# EasyEDA Pro project ProPrj_tang25k_YT8531C_V2.0_2026-08-23.epro, schematic Schematic1

## Sheets
1 GPIO: Board Name: tang25k; Create Date: 2025-06-27; Page Name: GPIO; Project Name: tang25k_YT8531C_V2.0; Schematic Name: Schematic1; Update Date: 2025-07-03; Company: EasyEDA.com; Page Size: A4; Version: V1.0
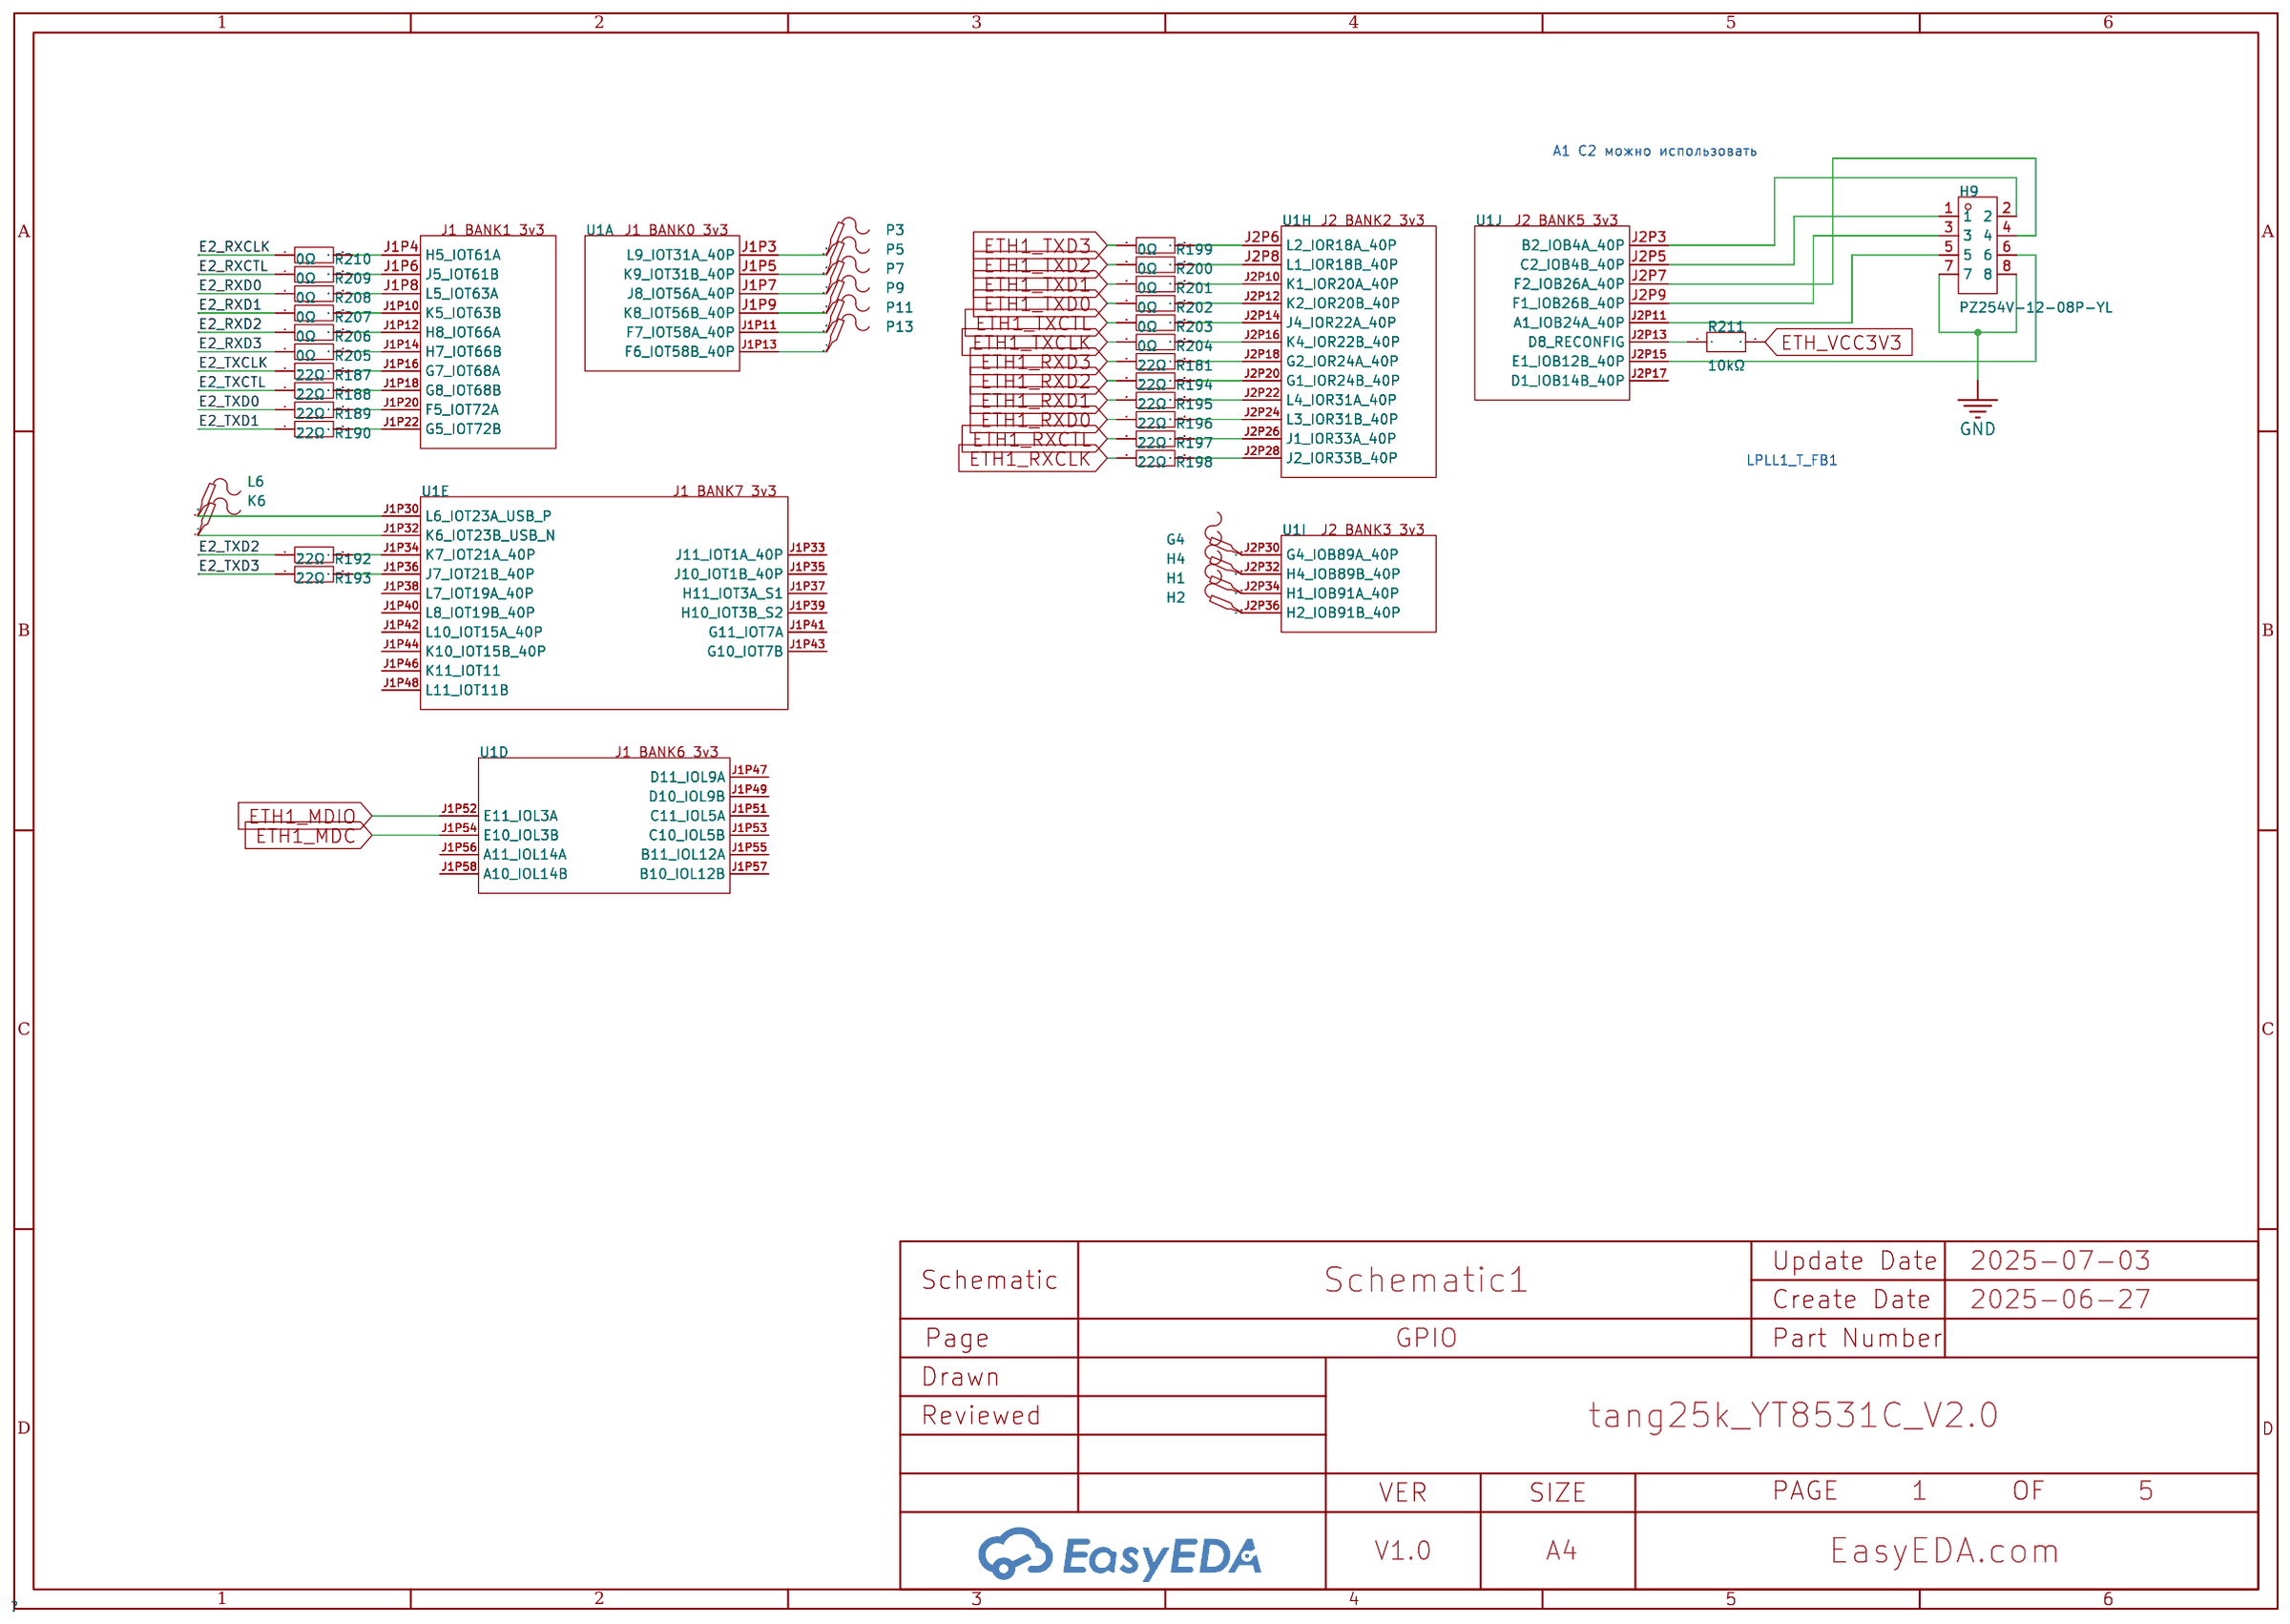
[diagram p1: GPIO]
2 power: Page Name: power; Update Date: 2025-07-04
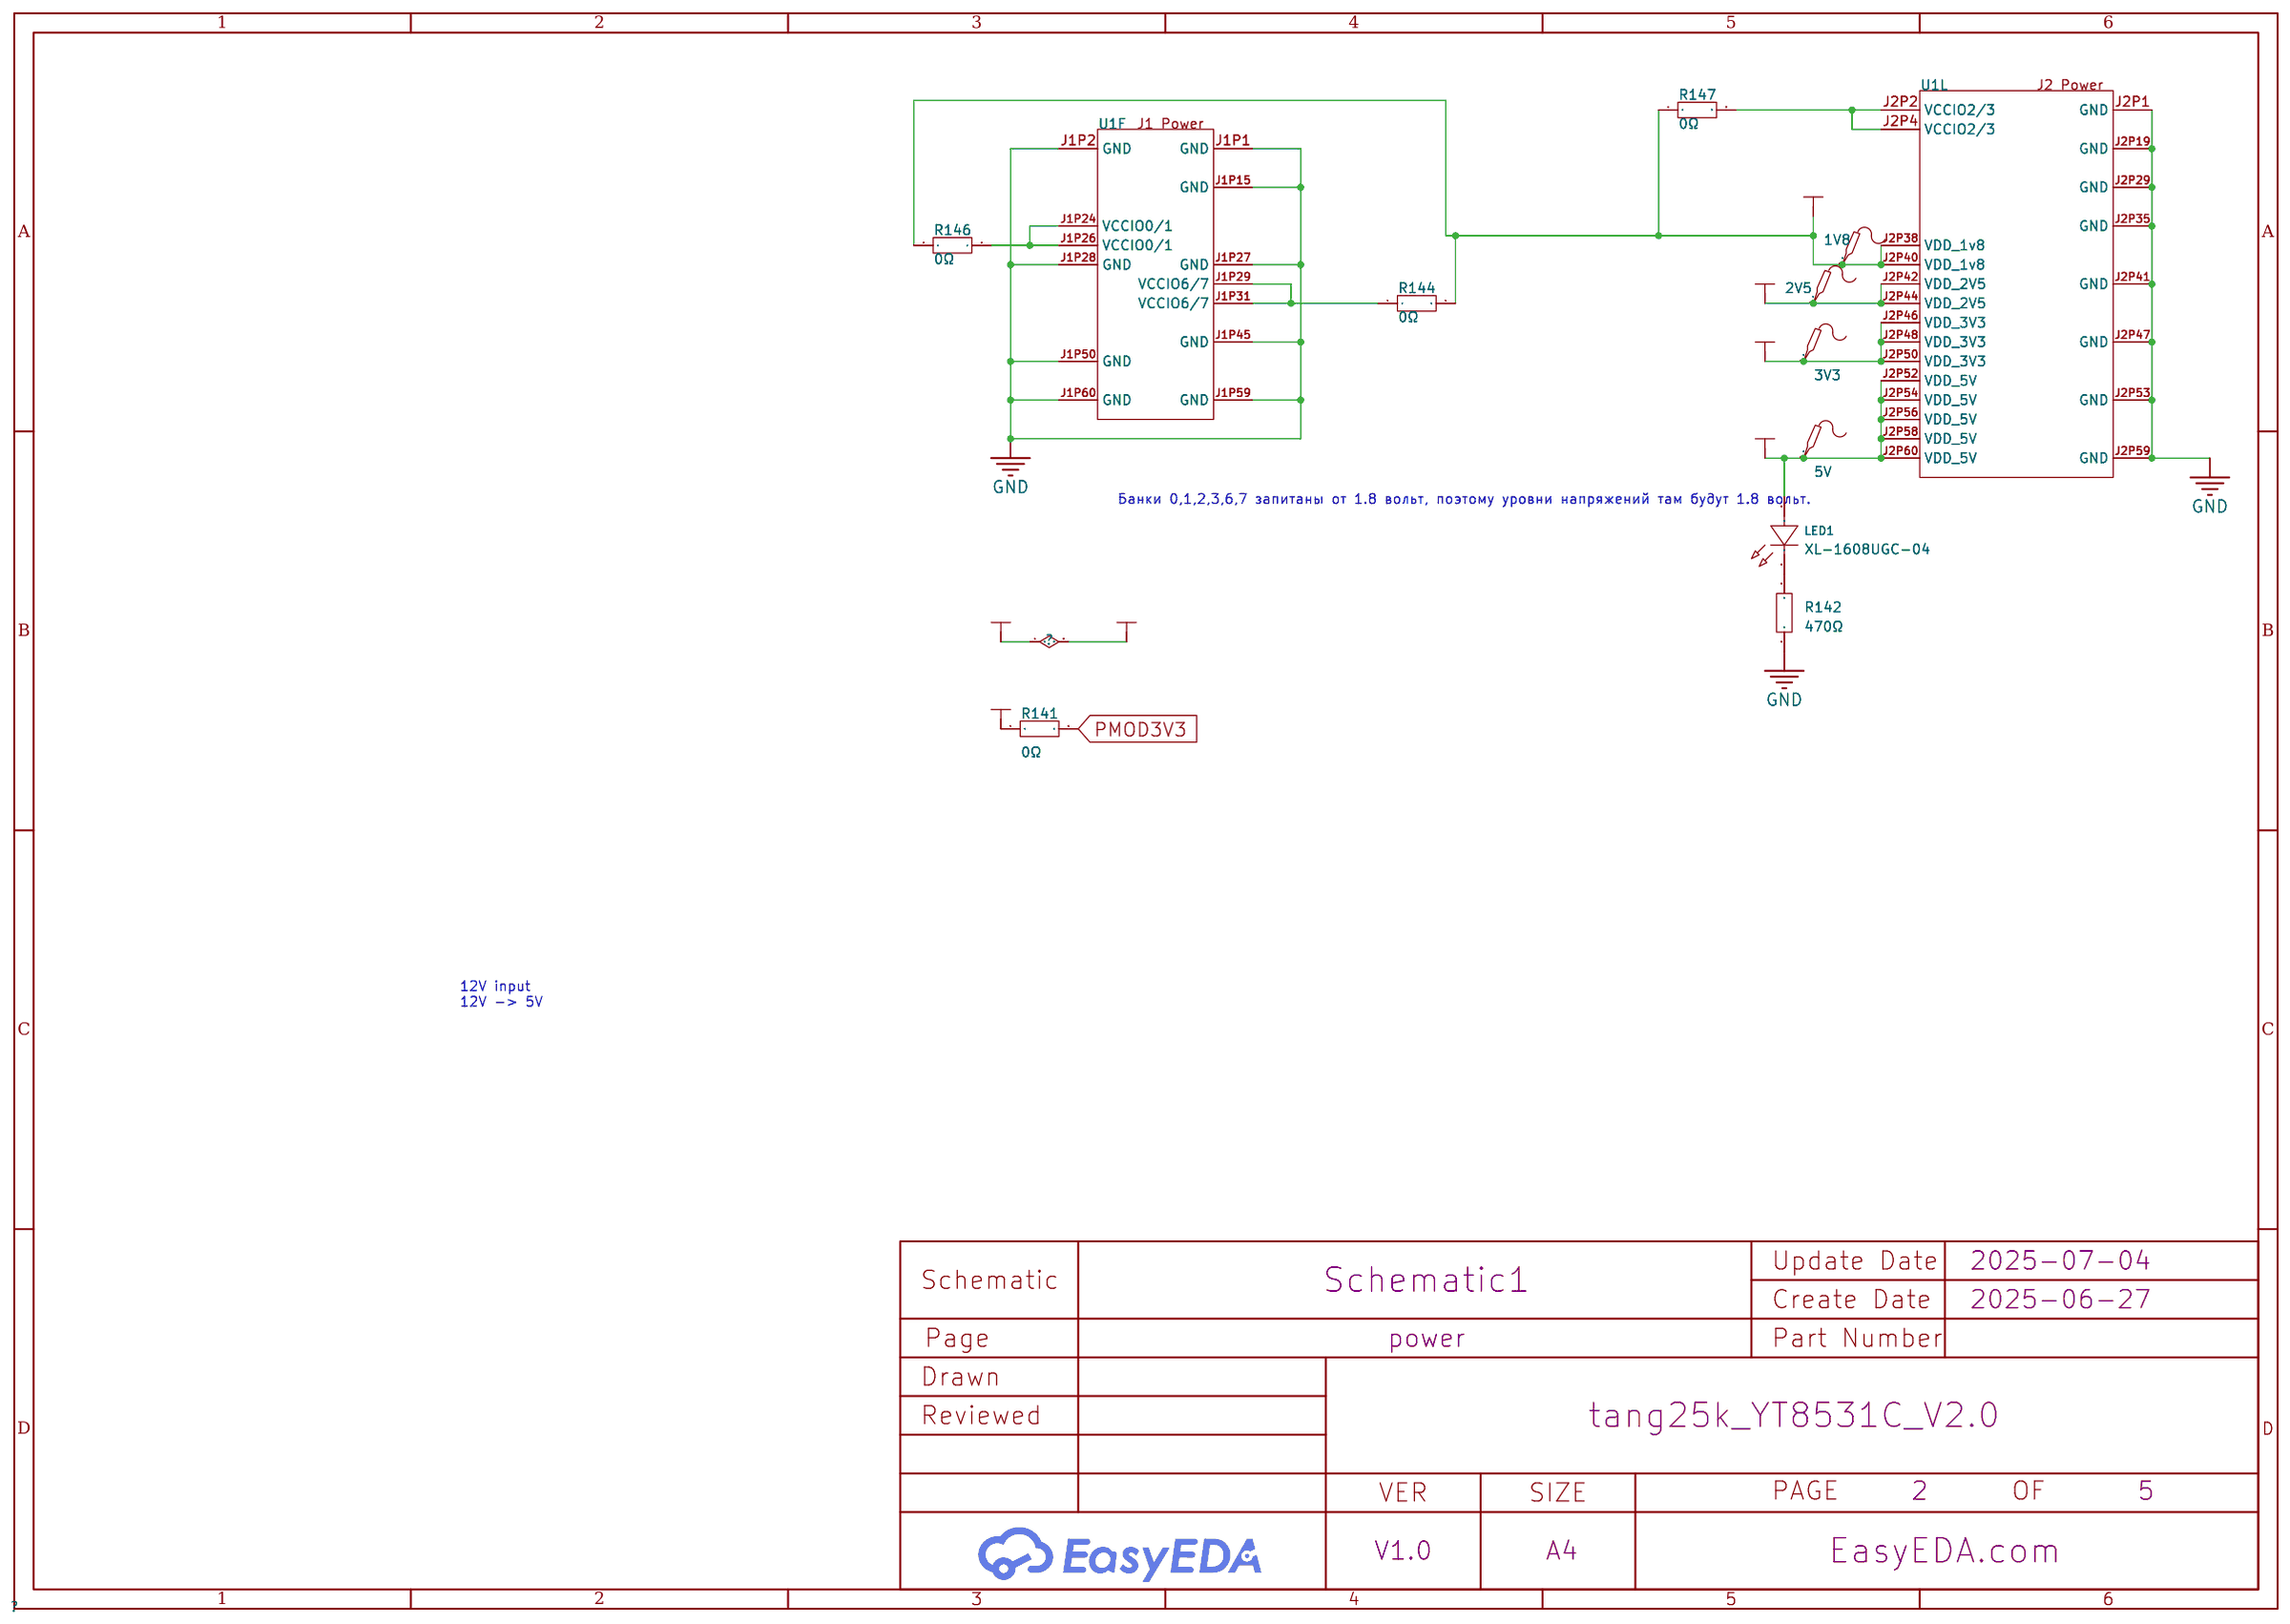
[diagram p2: power]
3 UART JTAG MIPI: Page Name: UART JTAG MIPI; Update Date: 2025-07-01
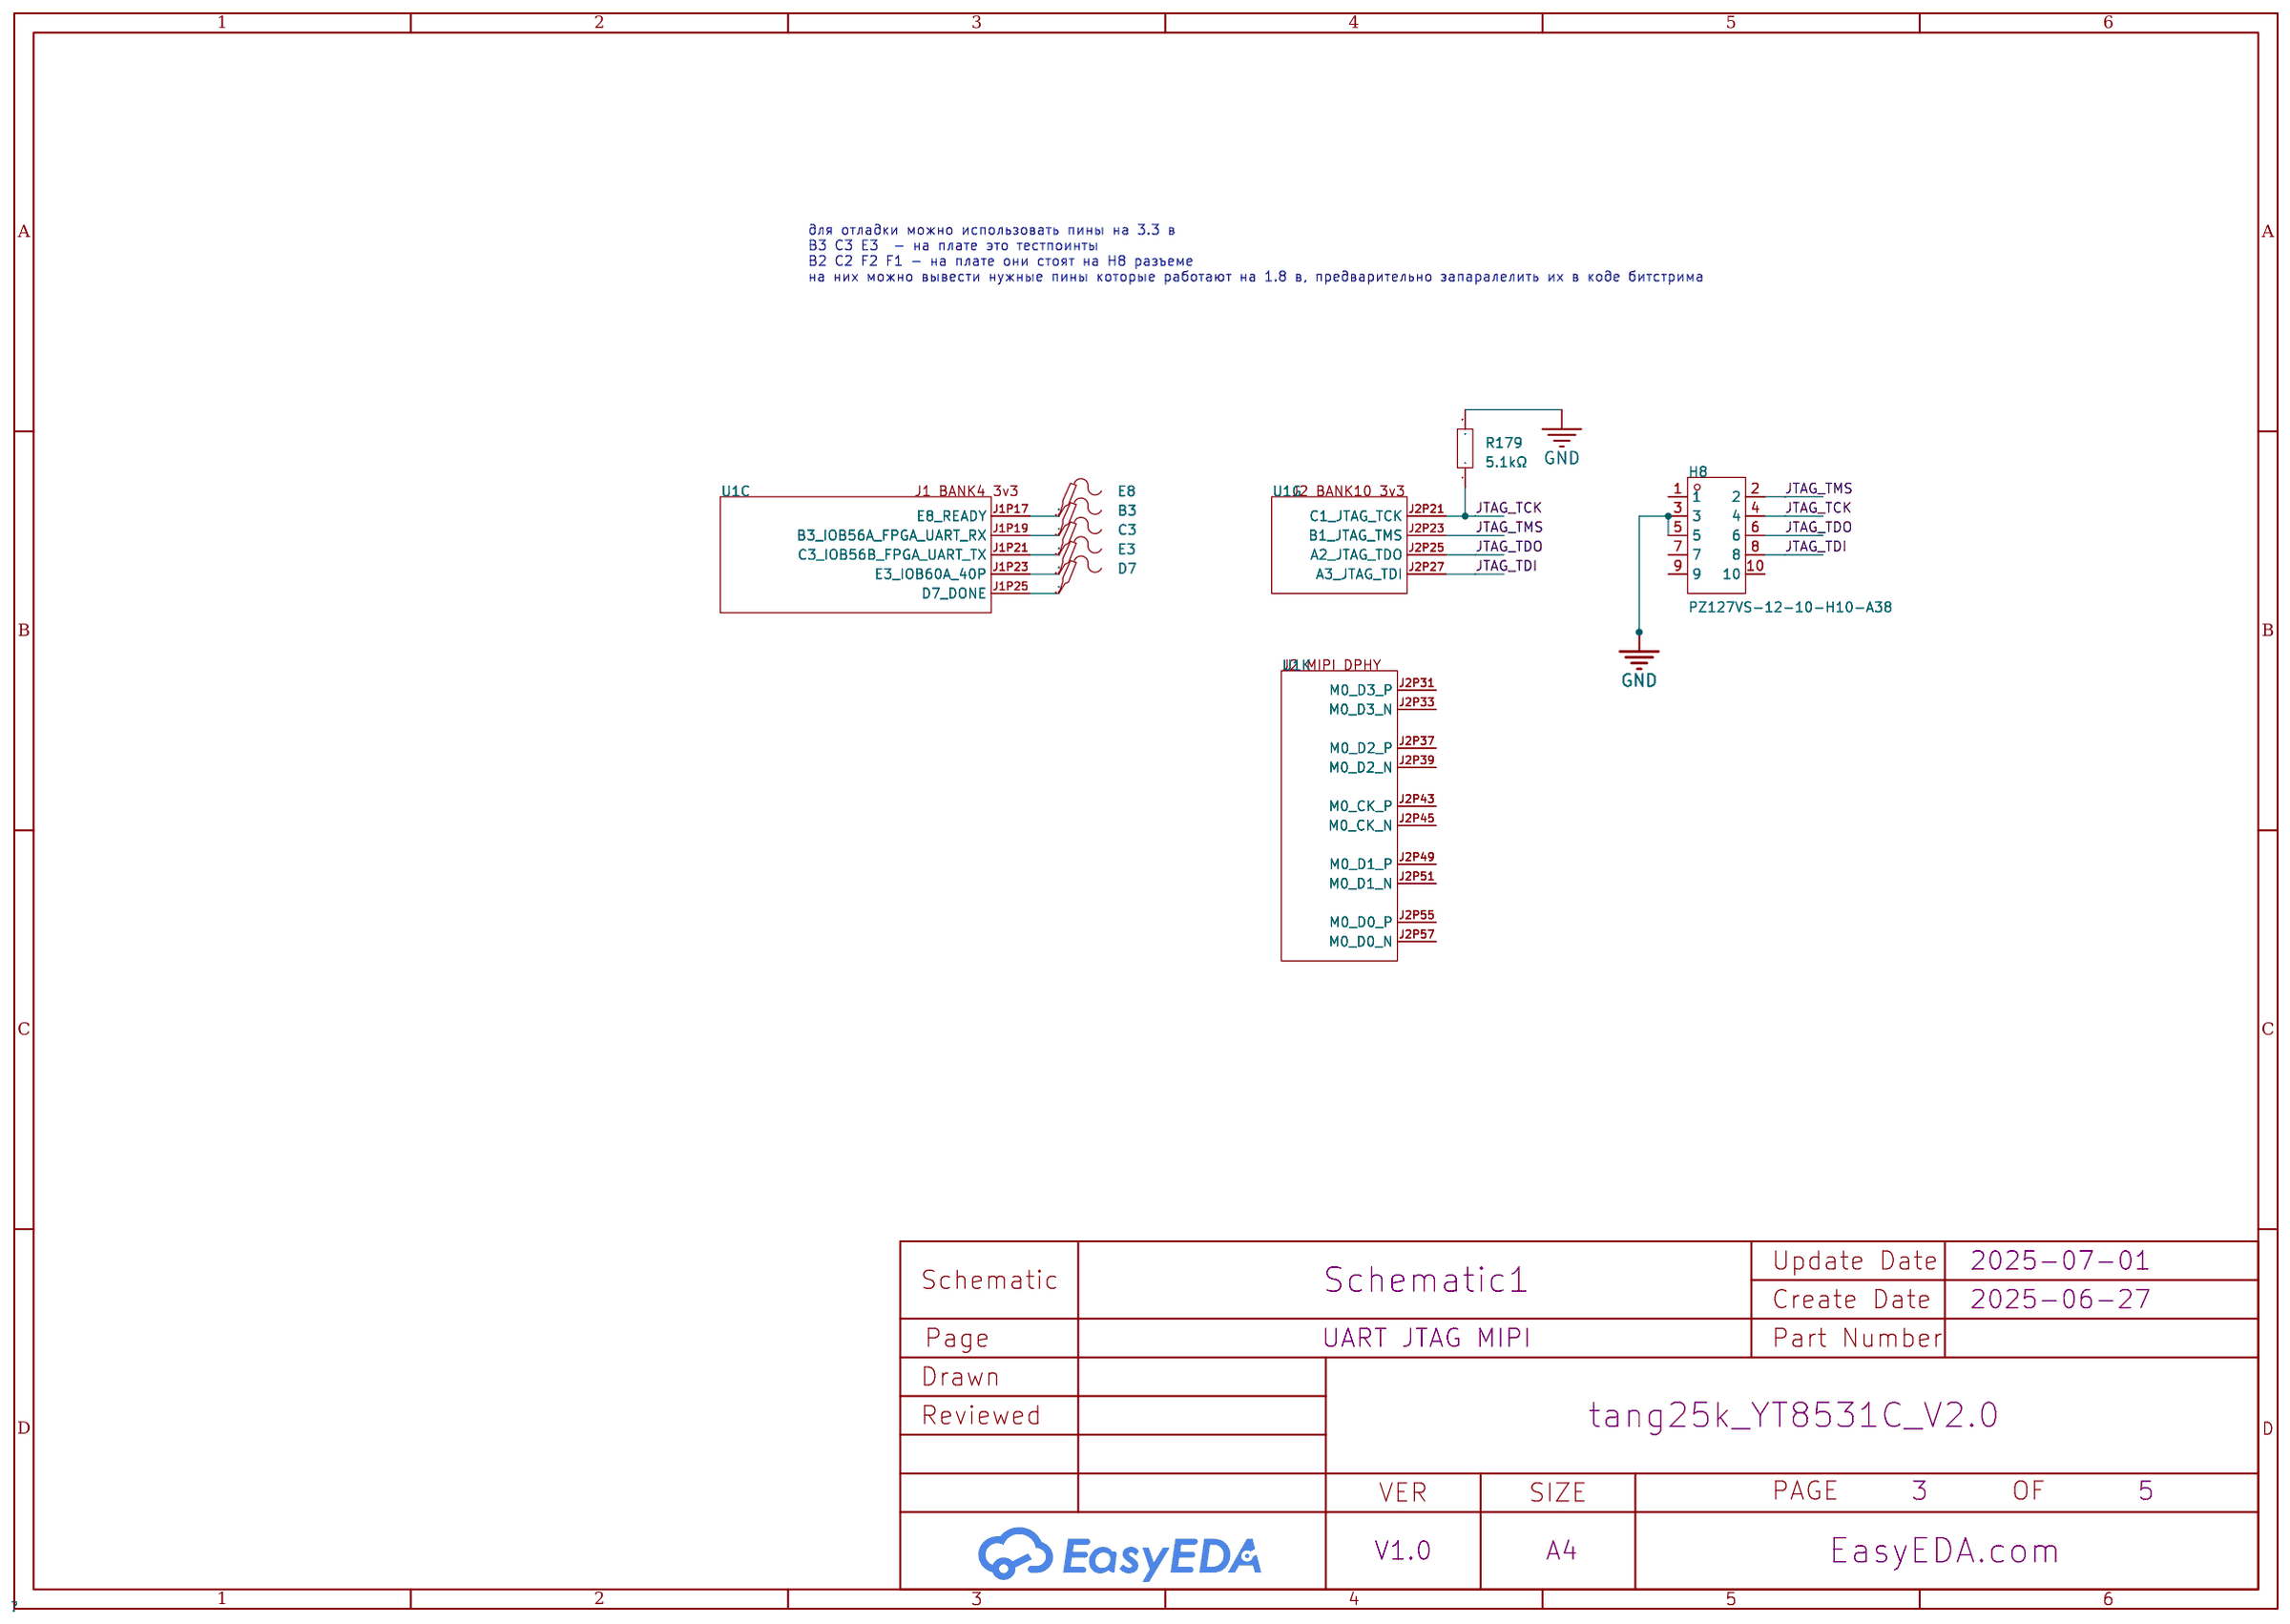
[diagram p3: UART JTAG MIPI]
4 ch1 copy: Page Name: ch1 copy; Add into BOM: yes; Company: Your Company; Convert to PCB: yes; Date: 2023-10-17; Draw By: asetmalik; REV: 1.0; Sheet: 1/1
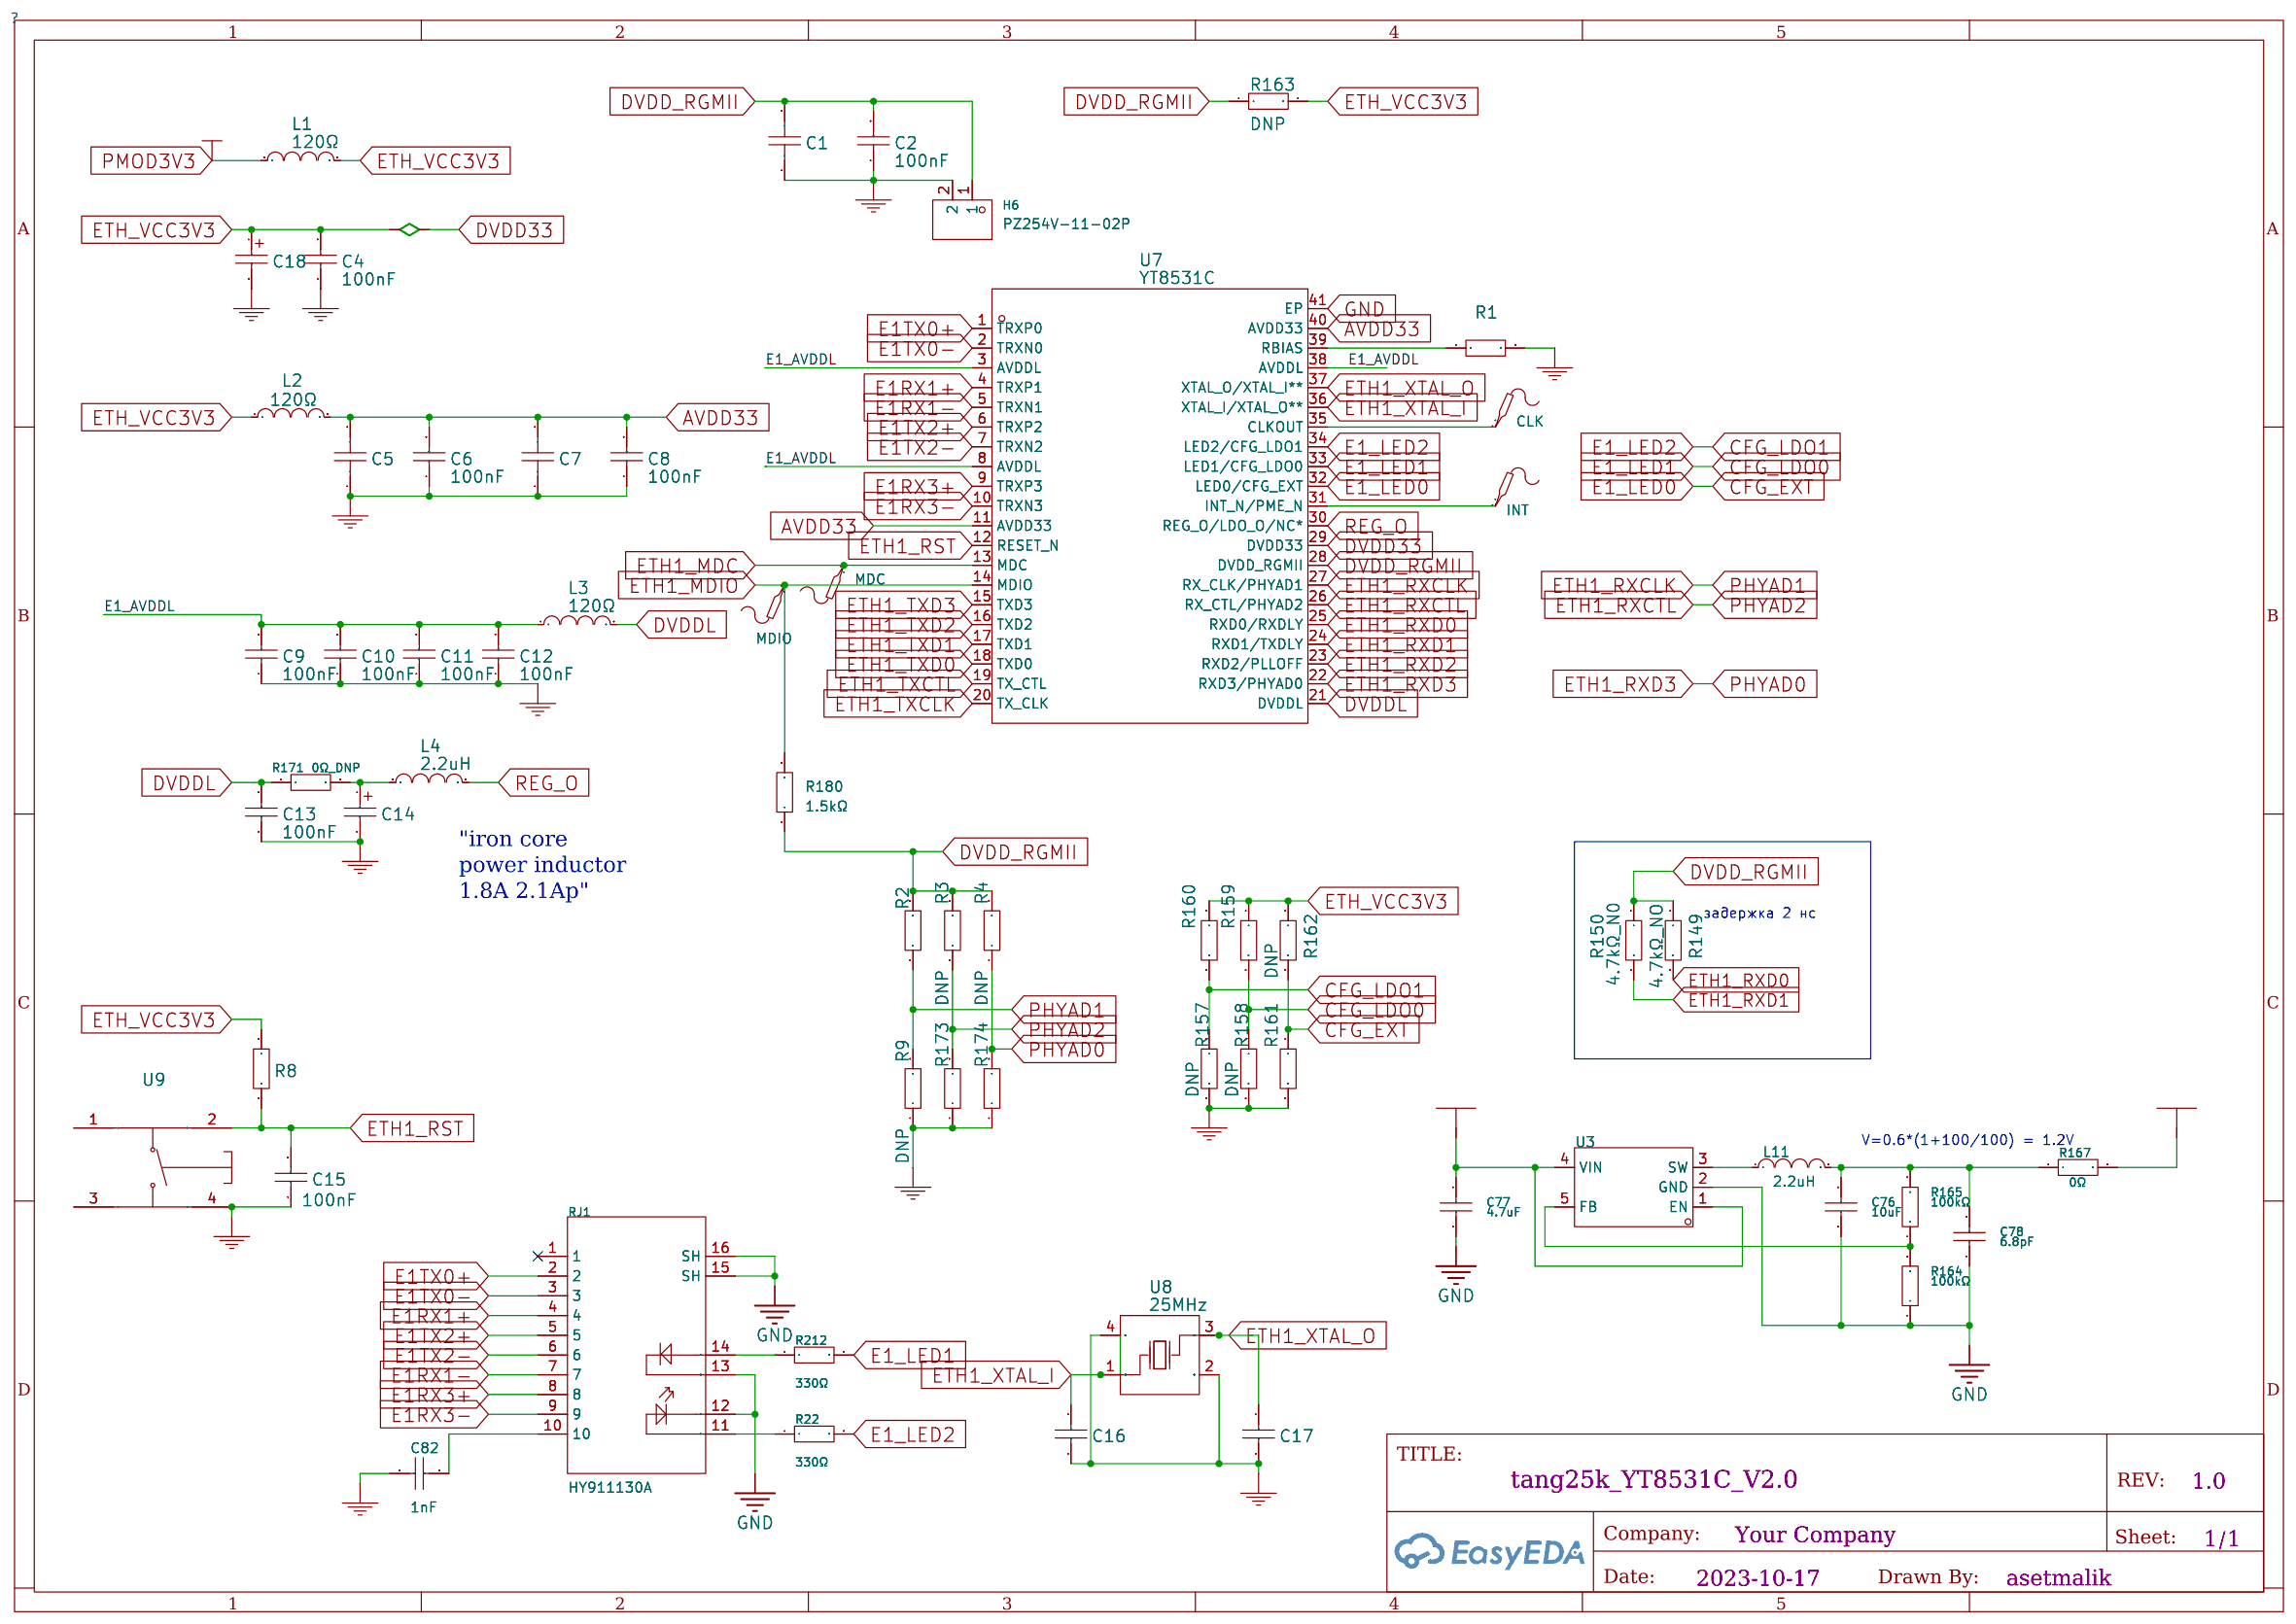
[diagram p4: ch1 copy]
5 ch2 copy: Page Name: ch2 copy; Update Date: 2025-07-02; Add into BOM: yes; Company: Your Company; Convert to PCB: yes; Date: 2023-10-17; Draw By: asetmalik; REV: 1.0; Sheet: 1/1
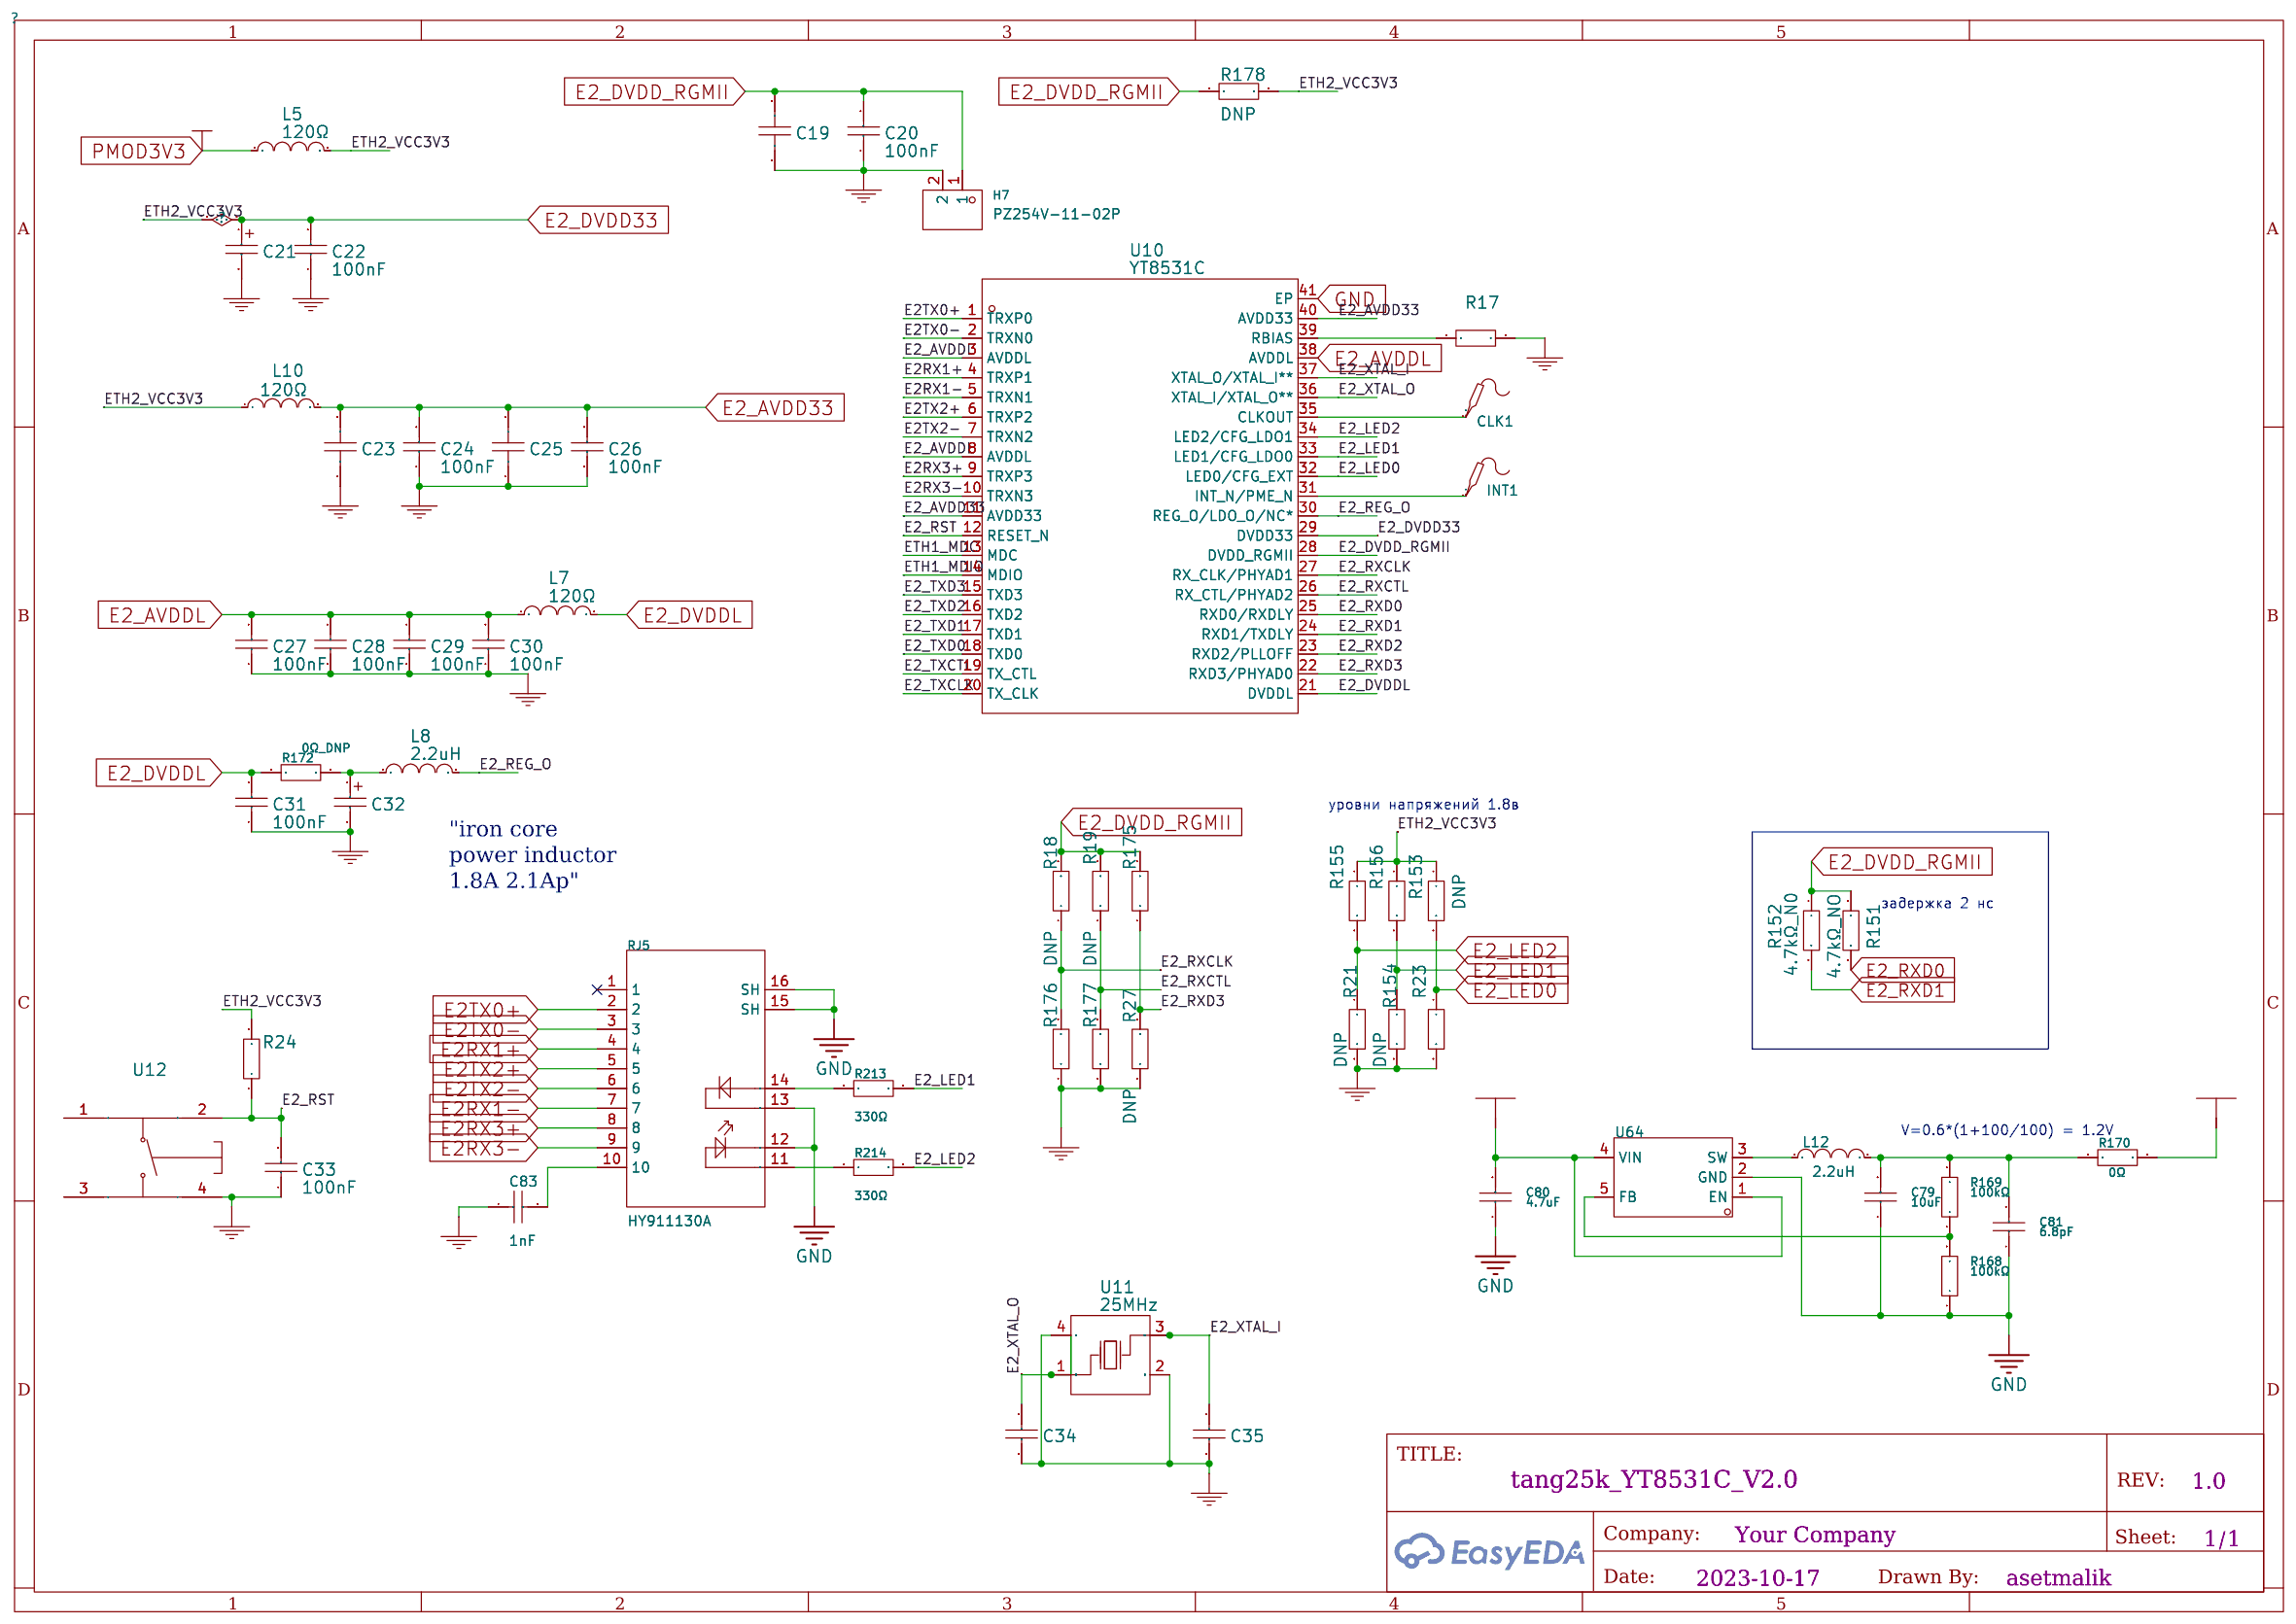
[diagram p5: ch2 copy]

## Parts
sheet ch1 copy
C1  1uF  [C0603]
C2  100nF  [C0603]
C4  100nF  [C0603]
C5  1uF  [C0603]
C6  100nF  [C0603]
C7  1uF  [C0603]
C8  100nF  [C0603]
C9  100nF  [C0603]
C10  100nF  [C0603]
C11  100nF  [C0603]
C12  100nF  [C0603]
C13  100nF  [C0603]
C14  10uF  [C0603]
C15  100nF  [C0603]
C16  12pF  [C0603]
C17  12pF  [C0603]
C18  10uF  [C0603]
C76  10uF  [C0402]
C77  4.7uF  [C0402]
C78  6.8pF  [C0402]
C82  1nF  [C1206]
CLK  -  [Test-Point-0.5mm]
H6  PZ254V-11-02P  [HDR-TH_2P-P2.54-V-M]
INT  -  [Test-Point-0.5mm]
L1  120Ω  [L0603]
L2  120Ω  [L0603]
L3  120Ω  [L0603]
L4  2.2uH  [IND-SMD_L2.5-W2.0_SLW252012P]
L11  2.2uH  [L0806]
MDC  -  [Test-Point-0.5mm]
MDIO  -  [Test-Point-0.5mm]
R1  2.49kΩ  [R0603]
R2  10kΩ  [R0603]
R3  10kΩ  [R0603]
R4  10kΩ  [R0603]
R8  4.7kΩ  [R0603]
R9  10kΩ  [R0603]
R22  330Ω  [R0402]
R149  4.7kΩ_NO  [R0603]
R150  4.7kΩ_N0  [R0603]
R157  4.7kΩ  [R0603]
R158  4.7kΩ  [R0603]
R159  4.7kΩ  [R0603]
R160  4.7kΩ  [R0603]
R161  4.7kΩ  [R0603]
R162  4.7kΩ  [R0603]
R163  4.7kΩ  [R0603]
R164  100kΩ  [R0402]
R165  100kΩ  [R0402]
R167  0Ω  [R0402]
R171  0Ω_DNP  [R0402]
R173  10kΩ  [R0603]
R174  10kΩ  [R0603]
R180  1.5kΩ  [R0603]
R212  330Ω  [R0402]
RJ1  HY911130A  [RJ45-TH_10P-P2.54-S2.54_L16.1-W21.4_HY911130A]
U3  TLV62569DBVR  [SOT-23-5_L3.0-W1.7-P0.95-LS2.8-BR]
U7  YT8531C  [QFN-40_L5.0-W5.0-P0.40-BL-EP3.7]
U8  25MHz  [CRYSTAL-SMD_4P-L2.5-W2.0-BL]
U9  TS-1187A-B-A-B  [SW-SMD_4P-L5.1-W5.1-P3.70-LS6.5-TL_H1.5]
sheet ch2 copy
C19  1uF  [C0603]
C20  100nF  [C0603]
C21  10uF  [C0603]
C22  100nF  [C0603]
C23  1uF  [C0603]
C24  100nF  [C0603]
C25  1uF  [C0603]
C26  100nF  [C0603]
C27  100nF  [C0603]
C28  100nF  [C0603]
C29  100nF  [C0603]
C30  100nF  [C0603]
C31  100nF  [C0603]
C32  10uF  [C0603]
C33  100nF  [C0603]
C34  12pF  [C0603]
C35  12pF  [C0603]
C79  10uF  [C0402]
C80  4.7uF  [C0402]
C81  6.8pF  [C0402]
C83  1nF  [C1206]
CLK1  -  [Test-Point-0.5mm]
H7  PZ254V-11-02P  [HDR-TH_2P-P2.54-V-M]
INT1  -  [Test-Point-0.5mm]
L5  120Ω  [L0603]
L7  120Ω  [L0603]
L8  2.2uH  [IND-SMD_L2.5-W2.0_SLW252012P]
L10  120Ω  [L0603]
L12  2.2uH  [L0806]
R17  2.49kΩ  [R0603]
R18  10kΩ  [R0603]
R19  10kΩ  [R0603]
R21  4.7kΩ  [R0603]
R23  4.7kΩ  [R0603]
R24  4.7kΩ  [R0603]
R27  10kΩ  [R0603]
R151  4.7kΩ_NO  [R0603]
R152  4.7kΩ_N0  [R0603]
R153  4.7kΩ  [R0603]
R154  4.7kΩ  [R0603]
R155  4.7kΩ  [R0603]
R156  4.7kΩ  [R0603]
R168  100kΩ  [R0402]
R169  100kΩ  [R0402]
R170  0Ω  [R0402]
R172  0Ω_DNP  [R0402]
R175  10kΩ  [R0603]
R176  10kΩ  [R0603]
R177  10kΩ  [R0603]
R178  4.7kΩ  [R0603]
R213  330Ω  [R0402]
R214  330Ω  [R0402]
RJ5  HY911130A  [RJ45-TH_10P-P2.54-S2.54_L16.1-W21.4_HY911130A]
U10  YT8531C  [QFN-40_L5.0-W5.0-P0.40-BL-EP3.7]
U11  25MHz  [CRYSTAL-SMD_4P-L2.5-W2.0-BL]
U12  TS-1187A-B-A-B  [SW-SMD_4P-L5.1-W5.1-P3.70-LS6.5-TL_H1.5]
U64  TLV62569DBVR  [SOT-23-5_L3.0-W1.7-P0.95-LS2.8-BR]
sheet GPIO
G4  -  [Test-Point-0.5mm]
H1  -  [Test-Point-0.5mm]
H2  -  [Test-Point-0.5mm]
H4  -  [Test-Point-0.5mm]
H9  PZ254V-12-08P-YL  [HDR-TH_8P-P2.54-V-M-R2-C4-S2.54]
K6  -  [Test-Point-0.5mm]
L6  -  [Test-Point-0.5mm]
P3  -  [Test-Point-0.5mm]
P5  -  [Test-Point-0.5mm]
P7  -  [Test-Point-0.5mm]
P9  -  [Test-Point-0.5mm]
P11  -  [Test-Point-0.5mm]
P13  -  [Test-Point-0.5mm]
R181  22Ω  [R0402]
R187  22Ω  [R0402]
R188  22Ω  [R0402]
R189  22Ω  [R0402]
R190  22Ω  [R0402]
R192  22Ω  [R0402]
R193  22Ω  [R0402]
R194  22Ω  [R0402]
R195  22Ω  [R0402]
R196  22Ω  [R0402]
R197  22Ω  [R0402]
R198  22Ω  [R0402]
R199  0Ω  [R0402]
R200  0Ω  [R0402]
R201  0Ω  [R0402]
R202  0Ω  [R0402]
R203  0Ω  [R0402]
R204  0Ω  [R0402]
R205  0Ω  [R0402]
R206  0Ω  [R0402]
R207  0Ω  [R0402]
R208  0Ω  [R0402]
R209  0Ω  [R0402]
R210  0Ω  [R0402]
R211  10kΩ  [R0603]
U1  -  [tang25k_som]  (sections BANK0,BANK1,BANK10,BANK2,BANK3,BANK5,BANK6,BANK7,Bank4,MIPI_DPHY_HardCore,power)
sheet power
1V8  -  [Test-Point-0.5mm]
2V5  -  [Test-Point-0.5mm]
3V3  -  [Test-Point-0.5mm]
5V  -  [Test-Point-0.5mm]
CBB1  -
LED1  XL-1608UGC-04  [LED0603-RD_GREEN]
R141  0Ω  [R0805]
R142  470Ω  [R0603]
R144  0Ω  [R0603]
R146  0Ω  [R0603]
R147  0Ω  [R0603]
U1#2  -  [tang25k_som]  (section power)
sheet UART JTAG MIPI
B3  -  [Test-Point-0.5mm]
C3  -  [Test-Point-0.5mm]
D7  -  [Test-Point-0.5mm]
E3  -  [Test-Point-0.5mm]
E8  -  [Test-Point-0.5mm]
H8  PZ127VS-12-10-H10-A38  [CONN-SMD_10P-P1.27_XFCN_PZ127VS-12-10-H10-A38]
R179  5.1kΩ  [R0603]

## Library data of the parts
C1 C5 C7 C19 C23 C25 = CL10A105KB8NNNC: Capacitance: Tolerance:±10% Tolerance:±10% Voltage Rated: Temperature Coefficient:; LCSC Part Name: 1uF ±10% 50V; Supplier Part: C15849; Manufacturer: SAMSUNG(三星); Supplier Footprint: 0603; JLCPCB Part Class: Basic Part; Datasheet: https://atta.szlcsc.com/upload/public/pdf/source/20160103/1457707679084.pdf; Supplier: LCSC; Tolerance: ±10%
C2 C4 C6 C8-C13 C15 C20 C22 C24 C26-C31 C33 = 100nF: Supplier: LCSC; Manufacturer: FH(风华); Manufacturer Part: 0603F104M500NT; Supplier Part: C42998; JLCPCB Part Class: Extended Part; link: https://lcsc.com/eda_search?q=C42998&amp;%26type=1&amp;ref=editor
C14 C18 C21 C32 = CL10A106MQ8NNNC: Capacitance: Tolerance:±20% Tolerance:±20% Voltage Rated: Temperature Coefficient:; LCSC Part Name: 10uF ±20% 6.3V; Supplier Part: C1691; Manufacturer: SAMSUNG(三星); Supplier Footprint: 0603; JLCPCB Part Class: Extended Part; Datasheet: https://atta.szlcsc.com/upload/public/pdf/source/20160218/1457707763339.pdf; Supplier: LCSC; Tolerance: ±20%
C16 C17 C34 C35 = CL10C120JB8NNNC: Capacitance: Tolerance:±5% Tolerance:±5% Voltage Rated: Temperature Coefficient:; LCSC Part Name: 12pF ±5% 50V; Supplier Part: C38523; Manufacturer: SAMSUNG(三星); Supplier Footprint: 0603; JLCPCB Part Class: Basic Part; Datasheet: https://atta.szlcsc.com/upload/public/pdf/source/20160218/1457707763339.pdf; Supplier: LCSC; Tolerance: ±5%
C76 C79 = CL05A106MQ5NUNC: Capacitance: Tolerance:±20% Tolerance:±20% Voltage Rated: Temperature Coefficient:; LCSC Part Name: 10uF ±20% 6.3V; Supplier Part: C15525; Manufacturer: SAMSUNG(三星); Supplier Footprint: 0402; JLCPCB Part Class: Basic Part; Datasheet: https://atta.szlcsc.com/upload/public/pdf/source/20220823/2B02EE04F8F211D38A52DCB16EB6BEBA.pdf; Supplier: LCSC; Tolerance: ±20%
C77 C80 = CL05A475MP5NRNC: Capacitance: Tolerance:±20% Tolerance:±20% Voltage Rated: Temperature Coefficient:; LCSC Part Name: 4.7uF ±20% 10V; Supplier Part: C23733; Manufacturer: SAMSUNG(三星); Supplier Footprint: 0402; JLCPCB Part Class: Basic Part; Datasheet: https://atta.szlcsc.com/upload/public/pdf/source/20160218/1457707763339.pdf; Supplier: LCSC; Tolerance: ±20%
C78 C81 = 0402CG6R8C500NT: Capacitance: Voltage Rated: Temperature Coefficient:; LCSC Part Name: 6.8pF 50V ±0.25pF; Supplier Part: C1576; Manufacturer: FH(风华); Supplier Footprint: 0402; JLCPCB Part Class: Extended Part; Datasheet: https://atta.szlcsc.com/upload/public/pdf/source/20200305/C486355_26A10D38EF8C2A5C37091D0039909270.pdf; Supplier: LCSC
C82 C83 = 1206B102K202NT: Capacitance: Tolerance:±10% Tolerance:±10% Voltage Rated: Temperature Coefficient:; LCSC Part Name: 1nF ±10% 2kV; Supplier Part: C9196; Manufacturer: FH(风华); Supplier Footprint: 1206; JLCPCB Part Class: Basic Part; Datasheet: https://atta.szlcsc.com/upload/public/pdf/source/20170923/C9196_1506149572183988986.pdf; Supplier: LCSC; Tolerance: ±10%
1V8 2V5 3V3 5V B3 C3 CLK CLK1 D7 E3 E8 G4 H1 H2 H4 INT INT1 K6 L6 MDC MDIO P3 P5 P7 P9 P11 P13 = Test-Point: Test Point 测试点
H6 H7 = PZ254V-11-02P: Number of Rows:Plugin Number of Pins:2P Pitch:2.54mm Pin Structure:1x2P Row Spacing:- Mounting Type:Straight Circluar Pins/Square Pins:Square Pins Current Rating (Max):- Voltage Rating (Max):- Length of Mating Pin:6mm Insulation Height:2.5mm Length of End; LCSC Part Name: 2.54mm 1x2P 直插 方针; Supplier Part: C492401; Manufacturer: XFCN(兴飞); Supplier Footprint: 插件,P=2.54mm; JLCPCB Part Class: Extended Part; Datasheet: https://atta.szlcsc.com/upload/public/pdf/source/20200309/C492401_A812433581A9B211A7FFA413ADDFF0E5.pdf; Supplier: LCSC; Number of Rows: Plugin; Number of Pins: 2P; Pitch: 2.54mm; Pin Structure: 1x2P; Mounting Type: Straight; Circluar Pins/Square Pins: Square Pins; Length of Mating Pin: 6mm; Insulation Height: 2.5mm; Length of End Connection Pin: 3mm; Operating Temperature Range: -40℃~+105℃; Color: Black
L1-L3 L5 L7 L10 = 120Ω: Supplier: LCSC; Manufacturer: FH(风华); Manufacturer Part: CBM160808U121T; Supplier Part: C62708; JLCPCB Part Class: Extended Part; link: https://lcsc.com/eda_search?q=C62708&amp;%26type=1&amp;ref=editor
L4 L8 = 2.2uH: Supplier: LCSC; Supplier Part: C844947; Manufacturer: VISHAY(威世); Manufacturer Part: IFSC1008ABER2R2M01; JLCPCB Part Class: Extended Part; link: https://lcsc.com/eda_search?q=C844947&amp;%26type=1&amp;ref=editor
L11 L12 = MLP2016V2R2MT0S1: Inductance: Tolerance:±20% Tolerance:±20% Rated Current: Saturation Current (Isat):- DC Resistance (DCR): Q @ Freq:- Frequency - Self Resonant:- Ratings:; LCSC Part Name: 2.2uH ±20% 170mΩ; Supplier Part: C307746; Manufacturer: TDK; Supplier Footprint: SMD,1.6x2mm; JLCPCB Part Class: Extended Part; Datasheet: https://atta.szlcsc.com/upload/public/pdf/source/20181022/C307746_B05CDBDAD30DACF0030C767E6DC56670.pdf; Supplier: LCSC; Tolerance: ±20%
R1 R17 = AR03DTDX2491: Type:Thin Film Resistor Resistance: Tolerance:±0.5% Tolerance:±0.5% Power(Watts): Temperature Coefficient:±50ppm/℃ Temperature Coefficient:±50ppm/℃ Overload Voltage (Max): Operating Temperature Range:-55℃~+155℃ Operating Temperature Range:-55℃~+155℃; LCSC Part Name: 薄膜电阻 2.49kΩ ±0.5% 100mW; Supplier Part: C319794; Manufacturer: Viking(光颉); Supplier Footprint: 0603; JLCPCB Part Class: Extended Part; Datasheet: https://atta.szlcsc.com/upload/public/pdf/source/20191129/C465721_10D49275DB41E427863CE9C8D788770A.pdf; Supplier: LCSC; Type: Thin Film Resistor; Tolerance: ±0.5%; Temperature Coefficient: ±50ppm/℃; Operating Temperature Range: -55℃~+155℃
R2-R4 R9 R18 R19 R27 R173-R177 = RC0603FR-0710KL: Type:Thick Film Resistors Resistance: Tolerance:±1% Tolerance:±1% Power(Watts): Temperature Coefficient:±100ppm/℃ Temperature Coefficient:±100ppm/℃ Overload Voltage (Max): Operating Temperature Range:-55℃~+155℃ Operating Temperature Range:-55℃~+155℃; LCSC Part Name: 10kΩ ±1% 100mW; Supplier Part: C98220; Manufacturer: YAGEO(国巨); Supplier Footprint: 0603; JLCPCB Part Class: Extended Part; Datasheet: https://atta.szlcsc.com/upload/public/pdf/source/20170522/1495423494387.pdf; Supplier: LCSC; Type: Thick Film Resistors; Tolerance: ±1%; Temperature Coefficient: ±100ppm/℃; Operating Temperature Range: -55℃~+155℃
R8 R21 R23 R24 R149-R163 R178 = 0603WAJ0472T5E_C25999: Type:Thick Film Resistors Resistance: Tolerance:±5% Tolerance:±5% Power(Watts): Temperature Coefficient:±100ppm/℃ Temperature Coefficient:±100ppm/℃ Overload Voltage (Max): Operating Temperature Range:-55℃~+155℃ Operating Temperature Range:-55℃~+155℃; LCSC Part Name: 厚膜电阻 4.7kΩ ±5% 100mW; Supplier Part: C25999; Manufacturer: UNI-ROYAL(厚声); Manufacturer Part: 0603WAJ0472T5E; Supplier Footprint: 0603; JLCPCB Part Class: Extended Part; Datasheet: https://atta.szlcsc.com/upload/public/pdf/source/20200306/C422600_1E6D84923E4A46A82E41ADD87F860B5C.pdf; Supplier: LCSC; Type: Thick Film Resistors; Tolerance: ±5%; Temperature Coefficient: ±100ppm/℃; Operating Temperature Range: -55℃~+155℃
R22 R212-R214 = 0402WGF3300TCE: Resistance: Tolerance:±1% Tolerance:±1% Power(Watts): Overload Voltage (Max): Temperature Coefficient:±100ppm/℃ Temperature Coefficient:±100ppm/℃ Type:Thick Film Resistors Operating Temperature Range:-55℃~+155℃ Operating Temperature Range:-55℃~+155℃; LCSC Part Name: 330Ω ±1% 62.5mW 厚膜电阻; Supplier Part: C25104; Manufacturer: UNI-ROYAL(厚声); Supplier Footprint: 0402; JLCPCB Part Class: Basic Part; Datasheet: https://atta.szlcsc.com/upload/public/pdf/source/20200306/C422600_1E6D84923E4A46A82E41ADD87F860B5C.pdf; Supplier: LCSC; Tolerance: ±1%; Temperature Coefficient: ±100ppm/℃; Type: Thick Film Resistors; Operating Temperature Range: -55℃~+155℃
R164 R165 R168 R169 = 0402WGF1003TCE: Resistance:100000Ω Tolerance:±1% Tolerance:±1% Power(Watts): Overload Voltage (Max): Temperature Coefficient:±100ppm/℃ Temperature Coefficient:±100ppm/℃ Type:Thick Film Resistors Operating Temperature Range:-55℃~+155℃ Operating Temperature Range:-55℃~+155; LCSC Part Name: 100kΩ ±1% 62.5mW 厚膜电阻; Supplier Part: C25741; Manufacturer: UNI-ROYAL(厚声); Supplier Footprint: 0402; JLCPCB Part Class: Basic Part; Datasheet: https://atta.szlcsc.com/upload/public/pdf/source/20200306/C422600_1E6D84923E4A46A82E41ADD87F860B5C.pdf; Supplier: LCSC; Tolerance: ±1%; Temperature Coefficient: ±100ppm/℃; Type: Thick Film Resistors; Operating Temperature Range: -55℃~+155℃
R167 R170-R172 = 0402WGF0000TCE: Resistance: Tolerance:±1% Tolerance:±1% Power(Watts): Overload Voltage (Max): Temperature Coefficient:±800ppm/℃ Temperature Coefficient:±800ppm/℃ Type:Thick Film Resistors Operating Temperature Range:-55℃~+155℃ Operating Temperature Range:-55℃~+155℃; LCSC Part Name: 0Ω ±1% 62.5mW 厚膜电阻; Supplier Part: C17168; Manufacturer: UNI-ROYAL(厚声); Supplier Footprint: 0402; JLCPCB Part Class: Basic Part; Datasheet: https://atta.szlcsc.com/upload/public/pdf/source/20200306/C422600_1E6D84923E4A46A82E41ADD87F860B5C.pdf; Supplier: LCSC; Tolerance: ±1%; Temperature Coefficient: ±800ppm/℃; Type: Thick Film Resistors; Operating Temperature Range: -55℃~+155℃
R180 = 0603WAF1501T5E: Type:Thick Film Resistors Resistance:1.5kΩ Tolerance:±1% Tolerance:±1% Power(Watts): Overload Voltage (Max): Temperature Coefficient:±100ppm/℃ Temperature Coefficient:±100ppm/℃ Operating Temperature Range:-55℃~+155℃ Operating Temperature Range:-55℃~+155℃; LCSC Part Name: 1.5kΩ ±1% 100mW 厚膜电阻; Supplier Part: C22843; Manufacturer: UNI-ROYAL(厚声); Supplier Footprint: 0603; JLCPCB Part Class: Basic Part; Datasheet: https://atta.szlcsc.com/upload/public/pdf/source/20200306/C422600_1E6D84923E4A46A82E41ADD87F860B5C.pdf; Supplier: LCSC; Type: Thick Film Resistors; Tolerance: ±1%; Temperature Coefficient: ±100ppm/℃; Operating Temperature Range: -55℃~+155℃
RJ1 RJ5 = HY911130A: Connector Type:RJReceptacle USOC Codes:RJ45 Number of Ports:1 Ratings:- Shielding:有屏蔽 LED:WithLED; LCSC Part Name: RJ45 带LED 1*1; Supplier Part: C55679; Manufacturer: HANRUN(汉仁); Supplier Footprint: 插件; JLCPCB Part Class: Extended Part; Datasheet: https://atta.szlcsc.com/upload/public/pdf/source/20151014/1457707458663.pdf; Supplier: LCSC; Connector Type: RJReceptacle; USOC Codes: RJ45; Number of Ports: 1; Shielding: 有屏蔽; LED: WithLED
U3 U64 = TLV62569DBVR: Function:Step-down type Synchronous Rectification:Yes Output Type:Adjustable Number of Outputs:- Topology:Step-down Input Voltage:2.5V~5.5V Input Voltage:2.5V~5.5V Output Voltage:0.6V~5.5V Output Voltage:0.6V~5.5V Output Current (Max):2A Switching Frequen; LCSC Part Name: 降压型 输入2.5V~5.5V 输出600mV~5.5V 2A; Supplier Part: C141836; Manufacturer: TI(德州仪器); Supplier Footprint: SOT-23-5; JLCPCB Part Class: Extended Part; Datasheet: https://atta.szlcsc.com/upload/public/pdf/source/20180423/C141836_1FC17A3D2C2E4ECD339DF92B83CED618.pdf; Supplier: LCSC; Function: Step-down type; Synchronous Rectification: Yes; Output Type: Adjustable; Topology: Step-down; Input Voltage: 2.5V~5.5V; Output Voltage: 0.6V~5.5V; Output Current (Max): 2A; Switching Frequency: 1.5MHz; Operating Temperature: -40℃~+125℃@(TJ)
U7 U10 = YT8531C: Supplier: LCSC; Supplier Part: C5357044; Manufacturer: Motorcomm（裕太微）; link: https://lcsc.com/eda_search?q=C5357044&amp;%26type=1&amp;ref=editor
U8 U11 = 25MHz: Supplier: LCSC; Supplier Part: C5203652; Manufacturer: TXC(晶技); Manufacturer Part: 8Z25000007; link: https://lcsc.com/eda_search?q=C5203652&amp;%26type=1&amp;ref=editor
U9 U12 = TS-1187A-B-A-B: Circuit:SPST Actuator Style:Round Button Operating Force:160gf Mounting Style:Brick nogging Switch Length:5.1mm Switch Width:5.1mm Switch Height:1.5mm Strike Gundam:不带 Contact Current:50mA Voltage Rating (DC):12V Insulation Resistance:- Actuator/Cap Color; LCSC Part Name: 5.1*5.1*1.5mm 立贴 轻触开关; Supplier Part: C318884; Manufacturer: XKB Connectivity(中国星坤); Supplier Footprint: SMD; JLCPCB Part Class: Basic Part; Datasheet: https://atta.szlcsc.com/upload/public/pdf/source/20200227/C318890_053E50208A88A7BA1965D8746000774E.pdf; Supplier: LCSC; Circuit: SPST; Actuator Style: Round Button; Operating Force: 160gf; Mounting Style: Brick nogging; Switch Length: 5.1mm; Switch Width: 5.1mm; Switch Height: 1.5mm; Strike Gundam: 不带; Contact Current: 50mA; Voltage Rating (DC): 12V; Actuator/Cap Color: 金色; With Lamp: No; Mechanical Life: 10万次; Operating Temperature: -30℃~+85℃
H9 = PZ254V-12-08P-YL: Supplier Part: C42393371; Manufacturer: XFCN(兴飞); Supplier Footprint: 插件,P=2.54mm; JLCPCB Part Class: Extended Part; Datasheet: https://atta.szlcsc.com/upload/public/pdf/source/20241121/3EBA92FF38AF0CE028397553129CD577.pdf; Supplier: LCSC
R181 R187-R190 R192-R198 = RC0402FR-0722RL: Type:Thick Film Resistors Resistance: Tolerance:±1% Tolerance:±1% Power(Watts): Overload Voltage (Max): Temperature Coefficient:±100ppm/℃ Temperature Coefficient:±100ppm/℃ Operating Temperature Range:-55℃~+155℃ Operating Temperature Range:-55℃~+155℃; LCSC Part Name: 厚膜电阻 22Ω ±1% 62.5mW; Supplier Part: C114765; Manufacturer: YAGEO(国巨); Supplier Footprint: 0402; JLCPCB Part Class: Extended Part; Datasheet: https://atta.szlcsc.com/upload/public/pdf/source/20180821/C275644_0D56F95EFF785E7D9A1FEF436B37DA78.pdf; Supplier: LCSC; Type: Thick Film Resistors; Tolerance: ±1%; Temperature Coefficient: ±100ppm/℃; Operating Temperature Range: -55℃~+155℃
R199-R210 = RC0402FR-070RL: Type:Thick Film Resistors Resistance:0Ω Tolerance:±1% Tolerance:±1% Power(Watts):62.5mW Voltage-Supply(Max):50V Temperature Coefficient:- Temperature Coefficient:- Operating Temperature:-55℃~+155℃ Operating Temperature:-55℃~+155℃; LCSC Part Name: 厚膜电阻 0Ω ±1% 62.5mW; Supplier Part: C106231; Manufacturer: YAGEO(国巨); Supplier Footprint: 0402; JLCPCB Part Class: Extended Part; Datasheet: https://atta.szlcsc.com/upload/public/pdf/source/20180927/C295883_E8D83085EA81BD7DE0B2B681138C15EE.pdf; Supplier: LCSC; Type: Thick Film Resistors; Tolerance: ±1%; Power(Watts): 62.5mW; Voltage-Supply(Max): 50V; Operating Temperature: -55℃~+155℃
R211 = FRC0603J103 TS: Type:Thick Film Resistors Resistance:10kΩ Tolerance:±5% Tolerance:±5% Power(Watts):0.1W Voltage-Supply(Max):75V Temperature Coefficient:±100ppm/℃ Temperature Coefficient:±100ppm/℃ Operating Temperature:-55℃~+155℃ Operating Temperature:-55℃~+155℃; LCSC Part Name: 10kΩ ±5% 100mW 厚膜电阻; Supplier Part: C2930027; Manufacturer: FOJAN(富捷); Supplier Footprint: 0603; JLCPCB Part Class: Extended Part; Datasheet: https://atta.szlcsc.com/upload/public/pdf/source/20211221/925EC7D7225764EE0046F22065062C87.pdf; Supplier: LCSC; Type: Thick Film Resistors; Tolerance: ±5%; Power(Watts): 0.1W; Voltage-Supply(Max): 75V; Temperature Coefficient: ±100ppm/℃; Operating Temperature: -55℃~+155℃
U1 U1#2 = tang25k
LED1 = XL-1608UGC-04: Lamp Holder Type:- Emitted Color:Emerald Forward Voltage (VF):- Forward Voltage (VF):- Power Dissipation:80mW Forward Current:25mA Dominant Wavelength:516nm~525nm Dominant Wavelength:516nm~525nm Peak Wavelength:534nm Diode Configuration:独立二极管 Lens Color:无; Supplier Part: C965804; Manufacturer: XINGLIGHT(成兴光); Supplier Footprint: 0603; JLCPCB Part Class: Extended Part; Datasheet: https://atta.szlcsc.com/upload/public/pdf/source/20221102/520D6E465E5CFD1609C8A4DBC80D4018.pdf; Supplier: LCSC; Emitted Color: Emerald; Power Dissipation: 80mW; Forward Current: 25mA; Dominant Wavelength: 516nm~525nm; Peak Wavelength: 534nm; Diode Configuration: 独立二极管; Lens Color: 无色透明透镜; Viewing Angle: 120°; Mounting Sytle: Positive post; Operating Temperature: -30℃~+85℃
R141 = RC0805FR-070RL: Type:Thick Film Resistors Resistance: Tolerance:±1% Tolerance:±1% Power(Watts): Overload Voltage (Max): Temperature Coefficient:- Temperature Coefficient:- Operating Temperature Range:-55℃~+155℃ Operating Temperature Range:-55℃~+155℃; LCSC Part Name: 厚膜电阻 0Ω ±1% 125mW; Supplier Part: C100045; Manufacturer: YAGEO(国巨); Supplier Footprint: 0805; JLCPCB Part Class: Extended Part; Datasheet: https://atta.szlcsc.com/upload/public/pdf/source/20180904/C276339_014E484F1DBA106FB92D45EABD5A1AC1.pdf; Supplier: LCSC; Type: Thick Film Resistors; Tolerance: ±1%; Operating Temperature Range: -55℃~+155℃
R142 = 0603WAF4700T5E: Type:Thick Film Resistors Resistance: Tolerance:±1% Tolerance:±1% Power(Watts): Overload Voltage (Max): Temperature Coefficient:±100ppm/℃ Temperature Coefficient:±100ppm/℃ Operating Temperature Range:-55℃~+155℃ Operating Temperature Range:-55℃~+155℃; LCSC Part Name: 470Ω ±1% 100mW 厚膜电阻; Supplier Part: C23179; Manufacturer: UNI-ROYAL(厚声); Supplier Footprint: 0603; JLCPCB Part Class: Basic Part; Datasheet: https://atta.szlcsc.com/upload/public/pdf/source/20200306/C422600_1E6D84923E4A46A82E41ADD87F860B5C.pdf; Supplier: LCSC; Type: Thick Film Resistors; Tolerance: ±1%; Temperature Coefficient: ±100ppm/℃; Operating Temperature Range: -55℃~+155℃
R144 R146 R147 = RC0603JR-070RL: Type:Thick Film Resistors Resistance: Tolerance:±5% Tolerance:±5% Power(Watts): Overload Voltage (Max): Operating Temperature Range:-55℃~+155℃ Operating Temperature Range:-55℃~+155℃; LCSC Part Name: 厚膜电阻 0Ω ±5% 100mW; Supplier Part: C95177; Manufacturer: YAGEO(国巨); Supplier Footprint: 0603; JLCPCB Part Class: Extended Part; Datasheet: https://atta.szlcsc.com/upload/public/pdf/source/20170217/1487301592412.pdf; Supplier: LCSC; Type: Thick Film Resistors; Tolerance: ±5%; Operating Temperature Range: -55℃~+155℃
H8 = PZ127VS-12-10-H10-A38: Pin Structure:2x5P Pitch:1.27mm Row Spacing:1.27mm Circluar Pins/Square Pins:Square Pins Mounting Type:Brick nogging Number of Rows:双排 Number of Pins:10P Current Rating (Max):1A Voltage Rating (Max):- Length of Mating Pin:3.8mm Insulation Height:1mm Lengt; LCSC Part Name: 间距:1.27mm 2x5P 立贴 方针; Supplier Part: C2935458; Manufacturer: XFCN(兴飞); Supplier Footprint: SMD,P=1.27mm; JLCPCB Part Class: Extended Part; Datasheet: https://atta.szlcsc.com/upload/public/pdf/source/20211224/A4012606B4E1095FC2168D2A0B647542.pdf; Supplier: LCSC; Pin Structure: 2x5P; Pitch: 1.27mm; Row Spacing: 1.27mm; Circluar Pins/Square Pins: Square Pins; Mounting Type: Brick nogging; Number of Rows: 双排; Number of Pins: 10P; Current Rating (Max): 1A; Length of Mating Pin: 3.8mm; Insulation Height: 1mm; Operating Temperature Range: -40℃~+105℃; Color: Black
R179 = 0603WAF5101T5E: Type:Thick Film Resistors Resistance:5.1kΩ Tolerance:±1% Tolerance:±1% Power(Watts): Overload Voltage (Max): Temperature Coefficient:±100ppm/℃ Temperature Coefficient:±100ppm/℃ Operating Temperature Range:-55℃~+155℃ Operating Temperature Range:-55℃~+155℃; LCSC Part Name: 5.1kΩ ±1% 100mW 厚膜电阻; Supplier Part: C23186; Manufacturer: UNI-ROYAL(厚声); Supplier Footprint: 0603; JLCPCB Part Class: Basic Part; Datasheet: https://atta.szlcsc.com/upload/public/pdf/source/20200306/C422600_1E6D84923E4A46A82E41ADD87F860B5C.pdf; Supplier: LCSC; Type: Thick Film Resistors; Tolerance: ±1%; Temperature Coefficient: ±100ppm/℃; Operating Temperature Range: -55℃~+155℃

## Nets
AVDD33: C5.2 C6.2 C7.2 C8.2 L2.2 U7.11(AVDD33) U7.40(AVDD33)
AVDDL: C27.2 C28.2 C29.2 C30.2 L7.1 U10.3(AVDDL) U10.8(AVDDL) U10.38(AVDDL)
DVDD33: C4.2 C18.1 L1.2 L2.1 R8.2 R159.1 R160.1 R162.1 R163.2 R211.2 U7.29(DVDD33)
DVDD_RGMII: C1.2 C2.2 H6.1 R2.2 R3.2 R4.2 R149.1 R150.1 R163.1 R180.1 U7.28(DVDD_RGMII)
DVDDL: C13.2 L3.2 R167.2 R171.1 U7.21(DVDDL)
GND: C1.1 C2.1 C4.1 C5.1 C6.1 C7.1 C8.1 C9.1 C10.1 C11.1 C12.1 C13.1 C14.2 C15.1 C16.2 C17.2 C18.2 C19.1 C20.1 C21.2 C22.1 C23.1 C24.1 C25.1 C26.1 C27.1 C28.1 C29.1 C30.1 C31.1 C32.2 C33.1 C34.2 C35.2 C76.1 C77.1 C78.1 C79.1 C80.1 C81.1 C82.1 C83.1 H6.2 H7.2 H8.3 H8.5 H9.7 H9.8 R1.2 R9.1 R17.2 R21.2 R23.2 R27.1 R142.1 R154.2 R157.2 R158.2 R161.2 R164.1 R168.1 R173.1 R174.1 R176.1 R177.1 R179.2 RJ1.12 RJ1.13 RJ1.15(SH) RJ1.16(SH) RJ5.12 RJ5.13 RJ5.15(SH) RJ5.16(SH) U1.J1P1(GND) U1.J1P2(GND) U1.J1P15(GND) U1.J1P27(GND) U1.J1P28(GND) U1.J1P45(GND) U1.J1P50(GND) U1.J1P59(GND) U1.J1P60(GND) U1#2.J2P1(GND) U1#2.J2P19(GND) U1#2.J2P29(GND) U1#2.J2P35(GND) U1#2.J2P41(GND) U1#2.J2P47(GND) U1#2.J2P53(GND) U1#2.J2P59(GND) U3.2(GND) U7.41(EP) U8.2(GND) U8.4(GND) U9.4 U10.41(EP) U11.2(GND) U11.4(GND) U12.4 U64.2(GND)
VCC5: 5V.1 LED1.2(A) U1#2.J2P52(VDD_5V) U1#2.J2P54(VDD_5V) U1#2.J2P56(VDD_5V) U1#2.J2P58(VDD_5V) U1#2.J2P60(VDD_5V)
VDD_1V8: 1V8.1 R144.2 R146.1 R147.1 U1#2.J2P38(VDD_1v8) U1#2.J2P40(VDD_1v8)
VDD_2V5: 2V5.1 U1#2.J2P42(VDD_2V5) U1#2.J2P44(VDD_2V5)
VDD_3V3: 3V3.1 R141.1 U1#2.J2P46(VDD_3V3) U1#2.J2P48(VDD_3V3) U1#2.J2P50(VDD_3V3)
CFG_EXT: R161.1 R162.2 U7.32(LED0/CFG_EXT)
CFG_LDO0: R158.1 R159.2 R212.2 U7.33(LED1/CFG_LDO0)
CFG_LDO1: R22.2 R157.1 R160.2 U7.34(LED2/CFG_LDO1)
E1_AVDDL: C9.2 C10.2 C11.2 C12.2 L3.1 U7.3(AVDDL) U7.8(AVDDL) U7.38(AVDDL)
E1RX1+: RJ1.4 U7.4(TRXP1)
E1RX1-: RJ1.7 U7.5(TRXN1)
E1RX3+: RJ1.8 U7.9(TRXP3)
E1RX3-: RJ1.9 U7.10(TRXN3)
E1TX0+: RJ1.2 U7.1(TRXP0)
E1TX0-: RJ1.3 U7.2(TRXN0)
E1TX2+: RJ1.5 U7.6(TRXP2)
E1TX2-: RJ1.6 U7.7(TRXN2)
E2_AVDD33: C23.2 C24.2 C25.2 C26.2 L10.2 U10.11(AVDD33) U10.40(AVDD33)
E2_DVDD33: C21.1 C22.2 L5.2 L10.1 R24.2 R153.1 R155.1 R156.1 R178.2 U10.29(DVDD33)
E2_DVDD_RGMII: C19.2 C20.2 H7.1 R18.2 R19.2 R151.1 R152.1 R175.2 R178.1 U10.28(DVDD_RGMII)
E2_DVDDL: C31.2 L7.2 R170.2 R172.1 U10.21(DVDDL)
E2_LED0: R23.1 R153.2 U10.32(LED0/CFG_EXT)
E2_LED1: R154.1 R156.2 R213.2 U10.33(LED1/CFG_LDO0)
E2_LED2: R21.1 R155.2 R214.2 U10.34(LED2/CFG_LDO1)
E2_REG_O: L8.2 U10.30(REG_O/LDO_O/NC*)
E2_RST: C33.2 R24.1 U10.12(RESET_N) U12.2
E2_RXCLK: R18.1 R176.2 R210.1 U10.27(RX_CLK/PHYAD1)
E2_RXCTL: R19.1 R177.2 R209.1 U10.26(RX_CTL/PHYAD2)
E2_RXD0: R151.2 R208.1 U10.25(RXD0/RXDLY)
E2_RXD1: R152.2 R207.1 U10.24(RXD1/TXDLY)
E2_RXD2: R206.1 U10.23(RXD2/PLLOFF)
E2_RXD3: R27.2 R175.1 R205.1 U10.22(RXD3/PHYAD0)
E2_TXCLK: R187.1 U10.20(TX_CLK)
E2_TXCTL: R188.1 U10.19(TX_CTL)
E2_TXD0: R189.1 U10.18(TXD0)
E2_TXD1: R190.1 U10.17(TXD1)
E2_TXD2: R192.1 U10.16(TXD2)
E2_TXD3: R193.1 U10.15(TXD3)
E2_XTAL_I: C35.1 U10.37(XTAL_O/XTAL_I**) U11.3(OSC2)
E2_XTAL_O: C34.1 U10.36(XTAL_I/XTAL_O**) U11.1(OSC1)
E2RX1+: RJ5.4 U10.4(TRXP1)
E2RX1-: RJ5.7 U10.5(TRXN1)
E2RX3+: RJ5.8 U10.9(TRXP3)
E2RX3-: RJ5.9 U10.10(TRXN3)
E2TX0+: RJ5.2 U10.1(TRXP0)
E2TX0-: RJ5.3 U10.2(TRXN0)
E2TX2+: RJ5.5 U10.6(TRXP2)
E2TX2-: RJ5.6 U10.7(TRXN2)
ETH1_MDC: MDC.1 U1.J1P54(E10_IOL3B) U7.13(MDC) U10.13(MDC)
ETH1_MDIO: MDIO.1 R180.2 U1.J1P52(E11_IOL3A) U7.14(MDIO) U10.14(MDIO)
ETH1_RST: C15.2 R8.1 U7.12(RESET_N) U9.2
ETH1_RXCLK: R2.1 R9.2 R198.1 U7.27(RX_CLK/PHYAD1)
ETH1_RXCTL: R3.1 R173.2 R197.1 U7.26(RX_CTL/PHYAD2)
ETH1_RXD0: R149.2 R196.1 U7.25(RXD0/RXDLY)
ETH1_RXD1: R150.2 R195.1 U7.24(RXD1/TXDLY)
ETH1_RXD2: R194.1 U7.23(RXD2/PLLOFF)
ETH1_RXD3: R4.1 R174.2 R181.1 U7.22(RXD3/PHYAD0)
ETH1_TXCLK: R204.1 U7.20(TX_CLK)
ETH1_TXCTL: R203.1 U7.19(TX_CTL)
ETH1_TXD0: R202.1 U7.18(TXD0)
ETH1_TXD1: R201.1 U7.17(TXD1)
ETH1_TXD2: R200.1 U7.16(TXD2)
ETH1_TXD3: R199.1 U7.15(TXD3)
ETH1_XTAL_I: C16.1 U7.36(XTAL_I/XTAL_O**) U8.1(OSC1)
ETH1_XTAL_O: C17.1 U7.37(XTAL_O/XTAL_I**) U8.3(OSC2)
JTAG_TCK: H8.4 R179.1 U1.J2P21(C1_JTAG_TCK)
JTAG_TDI: H8.8 U1.J2P27(A3_JTAG_TDI)
JTAG_TDO: H8.6 U1.J2P25(A2_JTAG_TDO)
JTAG_TMS: H8.2 U1.J2P23(B1_JTAG_TMS)
PMOD3V3: C77.2 C80.2 L1.1 L5.1 R141.2 U3.1(EN) U3.4(VIN) U64.1(EN) U64.4(VIN)
REG_O: L4.2 U7.30(REG_O/LDO_O/NC*)
$1N6065: P3.1 U1.J1P3(L9_IOT31A_40P)
$1N6068: P5.1 U1.J1P5(K9_IOT31B_40P)
$1N6071: P7.1 U1.J1P7(J8_IOT56A_40P)
$1N6074: P9.1 U1.J1P9(K8_IOT56B_40P)
$1N6077: P11.1 U1.J1P11(F7_IOT58A_40P)
$1N6080: P13.1 U1.J1P13(F6_IOT58B_40P)
$1N6471: L6.1 U1.J1P30(L6_IOT23A_USB_P)
$1N6999: G4.1 U1.J2P30(G4_IOB89A_40P)
$1N7020: H4.1 U1.J2P32(H4_IOB89B_40P)
$1N7041: H1.1 U1.J2P34(H1_IOB91A_40P)
$1N7062: H2.1 U1.J2P36(H2_IOB91B_40P)
$1N7116: R210.2 U1.J1P4(H5_IOT61A)
$1N7239: R209.2 U1.J1P6(J5_IOT61B)
$1N7282: R208.2 U1.J1P8(L5_IOT63A)
$1N7325: R207.2 U1.J1P10(K5_IOT63B)
$1N7368: R206.2 U1.J1P12(H8_IOT66A)
$1N7411: R205.2 U1.J1P14(H7_IOT66B)
$1N7577: R187.2 U1.J1P16(G7_IOT68A)
$1N7620: R188.2 U1.J1P18(G8_IOT68B)
$1N7663: R189.2 U1.J1P20(F5_IOT72A)
$1N7706: R190.2 U1.J1P22(G5_IOT72B)
$1N7749: K6.1 U1.J1P32(K6_IOT23B_USB_N)
$1N7792: R192.2 U1.J1P34(K7_IOT21A_40P)
$1N7835: R193.2 U1.J1P36(J7_IOT21B_40P)
$1N7915: R181.2 U1.J2P18(G2_IOR24A_40P)
$1N7958: R194.2 U1.J2P20(G1_IOR24B_40P)
$1N8001: R195.2 U1.J2P22(L4_IOR31A_40P)
$1N8044: R196.2 U1.J2P24(L3_IOR31B_40P)
$1N8087: R197.2 U1.J2P26(J1_IOR33A_40P)
$1N8130: R198.2 U1.J2P28(J2_IOR33B_40P)
$1N8173: R199.2 U1.J2P6(L2_IOR18A_40P)
$1N8216: R200.2 U1.J2P8(L1_IOR18B_40P)
$1N8259: R201.2 U1.J2P10(K1_IOR20A_40P)
$1N8302: R202.2 U1.J2P12(K2_IOR20B_40P)
$1N8345: R203.2 U1.J2P14(J4_IOR22A_40P)
$1N8388: R204.2 U1.J2P16(K4_IOR22B_40P)
$1N9572: R211.1 U1.J2P13(D8_RECONFIG)
$1N9717: H9.5 U1.J2P11(A1_IOB24A_40P)
$1N9727: H9.6 U1.J2P15(E1_IOB12B_40P)
$1N10709: H9.1 U1.J2P5(C2_IOB4B_40P)
$1N10712: H9.2 U1.J2P3(B2_IOB4A_40P)
$1N10739: H9.3 U1.J2P9(F1_IOB26B_40P)
$1N10747: H9.4 U1.J2P7(F2_IOB26A_40P)
$2N8219: LED1.1(K) R142.2
$2N8447: R144.1 U1.J1P29(VCCIO6/7) U1.J1P31(VCCIO6/7)
$2N8480: R146.2 U1.J1P24(VCCIO0/1) U1.J1P26(VCCIO0/1)
$4N1091: E8.1 U1.J1P17(E8_READY)
$4N1095: B3.1 U1.J1P19(B3_IOB56A_FPGA_UART_RX)
$4N1099: C3.1 U1.J1P21(C3_IOB56B_FPGA_UART_TX)
$4N1103: E3.1 U1.J1P23(E3_IOB60A_40P)
$4N1107: D7.1 U1.J1P25(D7_DONE)
$6N1035: R1.1 U7.39(RBIAS)
$6N25963: CLK.1 U7.35(CLKOUT)
$6N25986: INT.1 U7.31(INT_N/PME_N)
$6N28354: L11.1 U3.3(SW)
$6N28355: C76.2 C78.2 L11.2 R165.2 R167.1
$6N28357: R164.2 R165.1 U3.5(FB)
$6N28415: C14.1 L4.1 R171.2
$6N32173: C82.2 RJ1.10
$6N32193: R212.1 RJ1.14
$6N32194: R22.1 RJ1.11
$7N2111: R17.1 U10.39(RBIAS)
$7N2172: CLK1.1 U10.35(CLKOUT)
$7N23743: INT1.1 U10.31(INT_N/PME_N)
$7N25515: L12.1 U64.3(SW)
$7N25516: C79.2 C81.2 L12.2 R169.2 R170.1
$7N25518: R168.2 R169.1 U64.5(FB)
$7N25569: C32.1 L8.1 R172.2
$7N28798: C83.2 RJ5.10
$7N28818: R213.1 RJ5.14
$7N28819: R214.1 RJ5.11
Net-(R147-2): R147.2 U1#2.J2P2(VCCIO2/3) U1#2.J2P4(VCCIO2/3)

Not connected (* = marked no-connect by the designer): H8 1 7 9 10; RJ1 1*; RJ5 1*; U1 J1P33(J11_IOT1A_40P) J1P35(J10_IOT1B_40P) J1P37(H11_IOT3A_S1) J1P38(L7_IOT19A_40P) J1P39(H10_IOT3B_S2) J1P40(L8_IOT19B_40P) J1P41(G11_IOT7A) J1P42(L10_IOT15A_40P) J1P43(G10_IOT7B) J1P44(K10_IOT15B_40P) J1P46(K11_IOT11) J1P47(D11_IOL9A) J1P48(L11_IOT11B) J1P49(D10_IOL9B) J1P51(C11_IOL5A) J1P53(C10_IOL5B) J1P55(B11_IOL12A) J1P56(A11_IOL14A) J1P57(B10_IOL12B) J1P58(A10_IOL14B) J2P17(D1_IOB14B_40P) J2P31(M0_D3_P) J2P33(M0_D3_N) J2P37(M0_D2_P) J2P39(M0_D2_N) J2P43(M0_CK_P) J2P45(M0_CK_N) J2P49(M0_D1_P) J2P51(M0_D1_N) J2P55(M0_D0_P) J2P57(M0_D0_N); U9 1 3; U12 1 3

## Notes on the sheets
sheet 1
- A1 C2 можно использовать
- LPLL1_T_FB1
sheet 2
- Банки 0,1,2,3,6,7 запитаны от 1.8 вольт, поэтому уровни напряжений там будут 1.8 вольт.
- 12V input
  12V -> 5V
sheet 3
- для отладки можно использовать пины на 3.3 в
  B3 C3 E3  - на плате это тестпоинты
  B2 C2 F2 F1 - на плате они стоят на H8 разъеме
  на них можно вывести нужные пины которые работают на 1.8 в, предварительно запаралелить их в коде битстрима
sheet 4
- "iron core
  power inductor
  1.8A 2.1Ap"
- задержка 2 нс
- V=0.6*(1+100/100) = 1.2V
sheet 5
- "iron core
  power inductor
  1.8A 2.1Ap"
- уровни напряжений 1.8в
- задержка 2 нс
- V=0.6*(1+100/100) = 1.2V
